# Altium project DataloggerV3.x_Mainboard.PrjPcb (part 1 of 2)
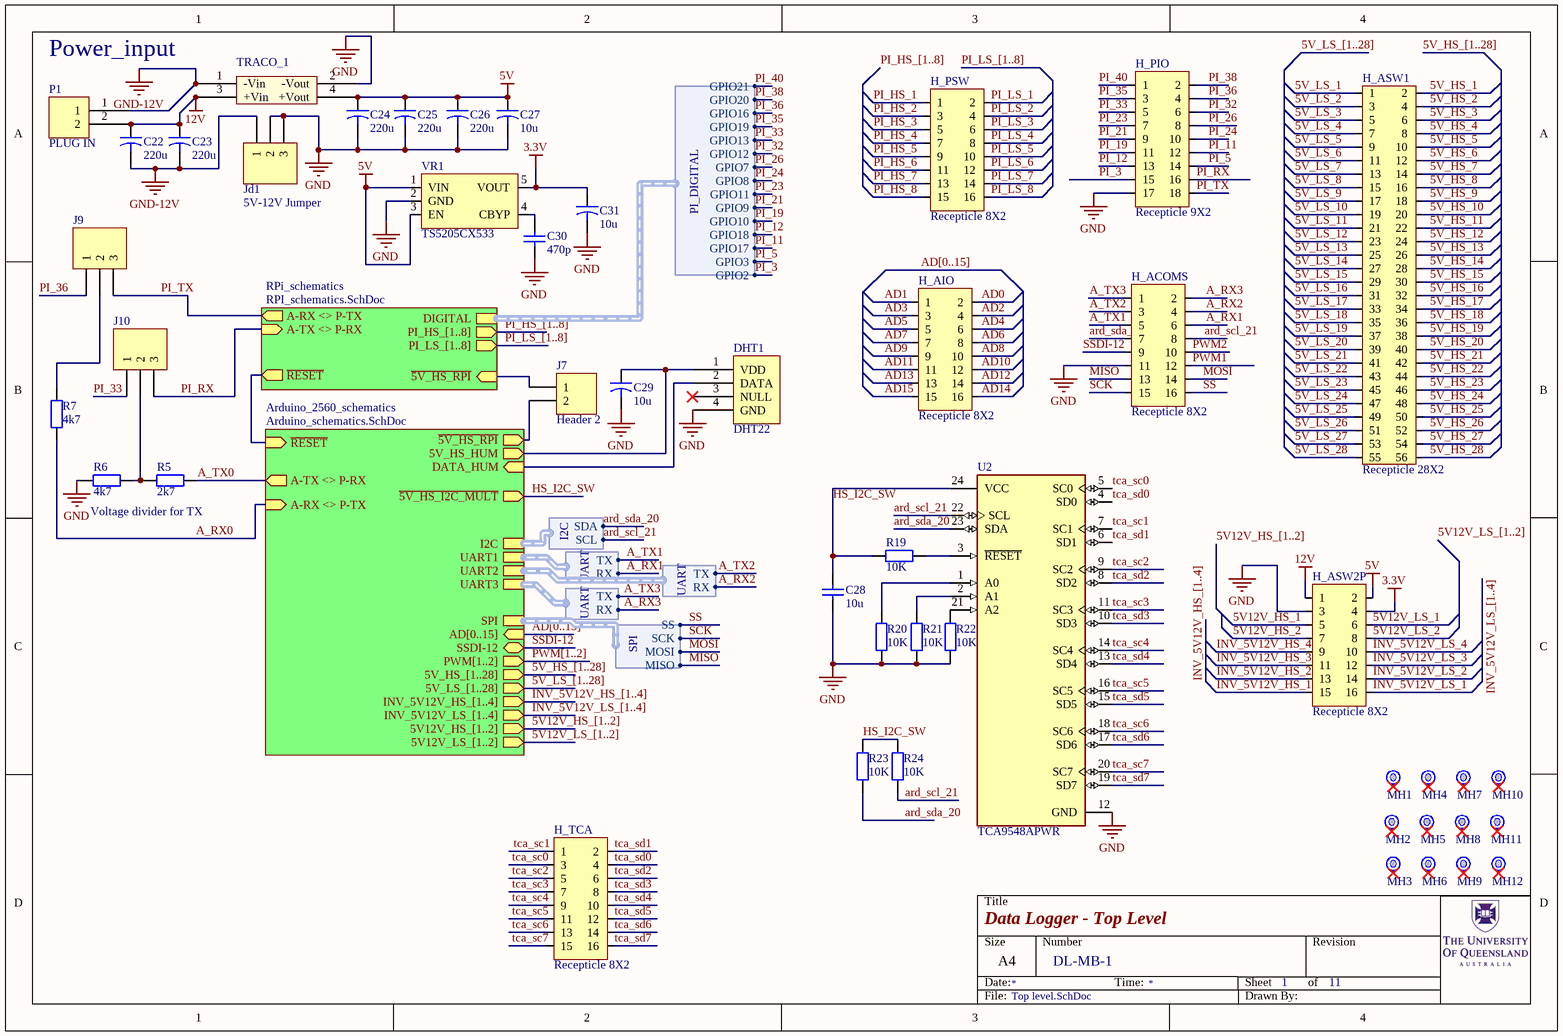
[diagram p0: Top level.SchDoc]
_Revision: 3.2.1B
11 sheets, 223 parts. Net scope: hierarchical (ports join the sheet entries above them; power ports are global).
Board files: PCB4.PcbDoc, PCB3.PcbDoc, PCB2.PcbDoc
Sheets:
  Top level.SchDoc
    RPi_schematics = RPI_schematics.SchDoc
      pi_3.3V_5V_switches = pi_3.3v_5v_switches.SchDoc
        SP1 = HS_LS_Switch_LOW_PWR.SchDoc
        SP2 = HS_LS_Switch_LOW_PWR.SchDoc
        SP3 = HS_LS_Switch_LOW_PWR.SchDoc
        SP4 = HS_LS_Switch_LOW_PWR.SchDoc
    Arduino_2560_schematics = Arduino_schematics.SchDoc
      Arduino switches = 5V_switches.SchDoc
        SA1 = HS_LS_Switch_LOW_PWR.SchDoc
        SA2 = HS_LS_Switch_LOW_PWR.SchDoc
        SA3 = HS_LS_Switch_LOW_PWR.SchDoc
        SA4 = HS_LS_Switch_LOW_PWR.SchDoc
        SA5 = HS_LS_Switch_LOW_PWR.SchDoc
        SA9 = HS_LS_Switch_LOW_PWR.SchDoc
        SA10 = HS_LS_Switch_LOW_PWR.SchDoc
        SA11 = HS_LS_Switch_LOW_PWR.SchDoc
        SA12 = HS_LS_Switch_LOW_PWR.SchDoc
        SA13 = HS_LS_Switch_LOW_PWR.SchDoc
        SA14 = HS_LS_Switch_LOW_PWR.SchDoc
        SA6 = HS_LS_Switch_LOW_PWR.SchDoc
        SA7 = HS_LS_Switch_LOW_PWR.SchDoc
        SA8 = HS_LS_Switch_LOW_PWR.SchDoc
      ISA - Arduino Option Inverted Switches = 12V_5V_switches.SchDoc
        ISA3 = Inverted_HS_LS_switch_HI_PWR.SchDoc
        ISA4 = Inverted_HS_LS_switch_HI_PWR.SchDoc
        ISA1 = Inverted_HS_LS_switch_HI_PWR.SchDoc
        ISA2 = Inverted_HS_LS_switch_HI_PWR.SchDoc
      SAO1 = HS_LS_switch_HI_PWR.SchDoc
      SAO2 = HS_LS_switch_HI_PWR.SchDoc
      SI-SH = HS_Inverted-Normal_Switch_LOW_PWR.SchDoc
      SR = Inverted_HS_switch_HI_PWR.SchDoc

## Sheet Top level.SchDoc: Data Logger - Top Level
size A4; DocumentNumber: DL-MB-1; Revision: 3.2.1B; SheetNumber: 1; SheetTotal: 11

### Parts
C22  220u  [CAPAE9083X80M]
C23  220u  [CAPR5-4X5]
C24  220u  [CAPR5-4X5]
C25  220u  [CAPAE9083X80M]
C26  220u  [CAPR5-4X5]
C27  10u  [CAPR5-4X5]
C28  10u  [RES-1206_M]
C29  10u  [CAPR5-4X5]
C30  470p  [RES-1206_M]
C31  10u  [CAPAE9083X80M]
DHT1  DHT22  [DHT22_HORIZONTAL]
H_ACOMS  Recepticle 8X2  [HDR2X8]
H_AIO  Recepticle 8X2  [HDR2X8]
H_ASW1  Recepticle 28X2  [HDR2X28]
H_ASW2P  Recepticle 8X2  [HDR2X8]
H_PIO  Recepticle 9X2  [HDR2X9]
H_PSW  Recepticle 8X2  [HDR2X8]
H_TCA  Recepticle 8X2  [HDR2X8]
J7  Header 2  [HDR1X2]
J9  Header 3  [HDR1X3]  (value not drawn)
J10  Header 3  [HDR1X3]  (value not drawn)
Jd1  5V-12V Jumper  [HDR1X3]
MH1  MOUNTING_HOLE  [M3]  (value not drawn)
MH2  MOUNTING_HOLE  [M3]  (value not drawn)
MH3  MOUNTING_HOLE  [M3]  (value not drawn)
MH4  MOUNTING_HOLE  [M3]  (value not drawn)
MH5  MOUNTING_HOLE  [M3]  (value not drawn)
MH6  MOUNTING_HOLE  [M3]  (value not drawn)
MH7  MOUNTING_HOLE  [M3]  (value not drawn)
MH8  MOUNTING_HOLE  [M3]  (value not drawn)
MH9  MOUNTING_HOLE  [M3]  (value not drawn)
MH10  MOUNTING_HOLE  [M3]  (value not drawn)
MH11  MOUNTING_HOLE  [M3]  (value not drawn)
MH12  MOUNTING_HOLE  [M3]  (value not drawn)
P1  PLUG IN  [PHOENIX_2PIN]
R5  2k7  [RES-1206_M]
R6  4k7  [RES-1206_M]
R7  4k7  [RES-1206_M]
R19  10K  [RES-1206_M]
R20  10K  [RES-1206_M]
R21  10K  [RES-1206_M]
R22  10K  [RES-1206_M]
R23  10K  [RES-1206_M]
R24  10K  [RES-1206_M]
TRACO_1  TRACO_12vto5.1_151121  [TRACO_12vto5.1_151121]  (value not drawn)
U2  TCA9548APWR  [FP-PW0024A-MFG]
VR1  TS5205CX533  [SOT-25]

### Sub-sheets
Arduino_2560_schematics = Arduino_schematics.SchDoc: ~{5V_HS_RPI} (out), ~{5V_HS_I2C_MULT} (out), DATA_HUM (in), 5V_HS_HUM (out), A-RX <> P-TX (in), A-TX <> P-RX (out), ~{RESET} (in), I2C (harness I2C), SPI (harness SPI), UART1 (harness UART), UART2 (harness UART), UART3 (harness UART), 5V_HS_[1..28] (out), 5V12V_HS_[1..2] (out), AD[0..15] (in), 5V12V_LS_[1..2] (out), INV_5V12V_HS_[1..4] (out), INV_5V12V_LS_[1..4] (out), 5V_LS_[1..28] (out), PWM[1..2] (out), SSDI-12 (bidir)
RPi_schematics = RPI_schematics.SchDoc: ~{5V_HS_RPI} (in), A-TX <> P-RX (in), A-RX <> P-TX (out), ~{RESET} (out), DIGITAL (harness PI_DIGITAL), PI_LS_[1..8] (out), PI_HS_[1..8] (out)

### Harnesses
I2C: SCL, SDA
UART: RX, TX
SPI: MISO, MOSI, SCK, SS
PI_DIGITAL: GPIO2, GPIO3, GPIO17, GPIO18, GPIO10, GPIO9, GPIO11, GPIO8, GPIO7, GPIO12, GPIO13, GPIO19, GPIO16, GPIO20, GPIO21

### Nets
3.3V: C31.1 H_ASW2P.4 VR1.5(VOUT)
5V: C24.1 C25.1 C26.1 C27.1 H_ASW2P.2 TRACO_1.4(+Vout) VR1.1(VIN) VR1.3(EN)
12V: C22.1 C23.1 H_ASW2P.1 P1.2 TRACO_1.3(+Vin)
GND: C24.2 C25.2 C26.2 C27.2 C28.2 C29.2 C30.2 C31.2 DHT1.4(GND) H_ACOMS.11 H_ASW2P.3 H_PIO.17 Jd1.2 Jd1.3 R6.2 R20.2 R21.2 R22.2 TRACO_1.2(-Vout) U2.12(GND) VR1.2(GND)
GND-12V: C22.2 C23.2 Jd1.1 P1.1 TRACO_1.1(-Vin)
5V12V_HS_1: H_ASW2P.5
5V12V_HS_2: H_ASW2P.7
5V12V_LS_1: H_ASW2P.6
5V12V_LS_2: H_ASW2P.8
5V_HS_1: H_ASW1.2
5V_HS_2: H_ASW1.4
5V_HS_3: H_ASW1.6
5V_HS_4: H_ASW1.8
5V_HS_5: H_ASW1.10
5V_HS_6: H_ASW1.12
5V_HS_7: H_ASW1.14
5V_HS_8: H_ASW1.16
5V_HS_9: H_ASW1.18
5V_HS_10: H_ASW1.20
5V_HS_11: H_ASW1.22
5V_HS_12: H_ASW1.24
5V_HS_13: H_ASW1.26
5V_HS_14: H_ASW1.28
5V_HS_15: H_ASW1.30
5V_HS_16: H_ASW1.32
5V_HS_17: H_ASW1.34
5V_HS_18: H_ASW1.36
5V_HS_19: H_ASW1.38
5V_HS_20: H_ASW1.40
5V_HS_21: H_ASW1.42
5V_HS_22: H_ASW1.44
5V_HS_23: H_ASW1.46
5V_HS_24: H_ASW1.48
5V_HS_25: H_ASW1.50
5V_HS_26: H_ASW1.52
5V_HS_27: H_ASW1.54
5V_HS_28: H_ASW1.56
5V_LS_1: H_ASW1.1
5V_LS_2: H_ASW1.3
5V_LS_3: H_ASW1.5
5V_LS_4: H_ASW1.7
5V_LS_5: H_ASW1.9
5V_LS_6: H_ASW1.11
5V_LS_7: H_ASW1.13
5V_LS_8: H_ASW1.15
5V_LS_9: H_ASW1.17
5V_LS_10: H_ASW1.19
5V_LS_11: H_ASW1.21
5V_LS_12: H_ASW1.23
5V_LS_13: H_ASW1.25
5V_LS_14: H_ASW1.27
5V_LS_15: H_ASW1.29
5V_LS_16: H_ASW1.31
5V_LS_17: H_ASW1.33
5V_LS_18: H_ASW1.35
5V_LS_19: H_ASW1.37
5V_LS_20: H_ASW1.39
5V_LS_21: H_ASW1.41
5V_LS_22: H_ASW1.43
5V_LS_23: H_ASW1.45
5V_LS_24: H_ASW1.47
5V_LS_25: H_ASW1.49
5V_LS_26: H_ASW1.51
5V_LS_27: H_ASW1.53
5V_LS_28: H_ASW1.55
A_RX0: R7.2 ; sheet Arduino_2560_schematics/A-RX <> P-TX
A_RX1: H_ACOMS.6 ; sheet Arduino_2560_schematics/UART1.RX
A_RX2: H_ACOMS.4 ; sheet Arduino_2560_schematics/UART2.RX
A_RX3: H_ACOMS.2 ; sheet Arduino_2560_schematics/UART3.RX
A_TX0: R5.1 ; sheet Arduino_2560_schematics/A-TX <> P-RX
A_TX1: H_ACOMS.5 ; sheet Arduino_2560_schematics/UART1.TX
A_TX2: H_ACOMS.3 ; sheet Arduino_2560_schematics/UART2.TX
A_TX3: H_ACOMS.1 ; sheet Arduino_2560_schematics/UART3.TX
AD0: DHT1.2(DATA) H_AIO.2 ; sheet Arduino_2560_schematics/DATA_HUM
AD1: H_AIO.1
AD2: H_AIO.4
AD3: H_AIO.3
AD4: H_AIO.6
AD5: H_AIO.5
AD6: H_AIO.8
AD7: H_AIO.7
AD8: H_AIO.10
AD9: H_AIO.9
AD10: H_AIO.12
AD11: H_AIO.11
AD12: H_AIO.14
AD13: H_AIO.13
AD14: H_AIO.16
AD15: H_AIO.15
ard_scl_21: H_ACOMS.8 R24.2 U2.22(SCL) ; sheet Arduino_2560_schematics/I2C.SCL
ard_sda_20: H_ACOMS.7 R23.2 U2.23(SDA) ; sheet Arduino_2560_schematics/I2C.SDA
HS_I2C_SW: C28.1 R19.1 R23.1 R24.1 U2.24(VCC) ; sheet Arduino_2560_schematics/~{5V_HS_I2C_MULT}
INV_5V12V_HS_1: H_ASW2P.15
INV_5V12V_HS_2: H_ASW2P.13
INV_5V12V_HS_3: H_ASW2P.11
INV_5V12V_HS_4: H_ASW2P.9
INV_5V12V_LS_1: H_ASW2P.16
INV_5V12V_LS_2: H_ASW2P.14
INV_5V12V_LS_3: H_ASW2P.12
INV_5V12V_LS_4: H_ASW2P.10
MISO: H_ACOMS.13 ; sheet Arduino_2560_schematics/SPI.MISO
MOSI: H_ACOMS.14 ; sheet Arduino_2560_schematics/SPI.MOSI
PI_3: H_PIO.15 ; sheet RPi_schematics/DIGITAL.GPIO2
PI_5: H_PIO.14 ; sheet RPi_schematics/DIGITAL.GPIO3
PI_11: H_PIO.12 ; sheet RPi_schematics/DIGITAL.GPIO17
PI_12: H_PIO.13 ; sheet RPi_schematics/DIGITAL.GPIO18
PI_13: sheet RPi_schematics/~{RESET}, sheet Arduino_2560_schematics/~{RESET}
PI_19: H_PIO.11 ; sheet RPi_schematics/DIGITAL.GPIO10
PI_21: H_PIO.9 ; sheet RPi_schematics/DIGITAL.GPIO9
PI_23: H_PIO.7 ; sheet RPi_schematics/DIGITAL.GPIO11
PI_24: H_PIO.10 ; sheet RPi_schematics/DIGITAL.GPIO8
PI_26: H_PIO.8 ; sheet RPi_schematics/DIGITAL.GPIO7
PI_32: H_PIO.6 ; sheet RPi_schematics/DIGITAL.GPIO12
PI_33: H_PIO.5 J10.1 ; sheet RPi_schematics/DIGITAL.GPIO13
PI_35: H_PIO.3 ; sheet RPi_schematics/DIGITAL.GPIO19
PI_36: H_PIO.4 J9.1 ; sheet RPi_schematics/DIGITAL.GPIO16
PI_38: H_PIO.2 ; sheet RPi_schematics/DIGITAL.GPIO20
PI_40: H_PIO.1 ; sheet RPi_schematics/DIGITAL.GPIO21
PI_HS_1: H_PSW.1
PI_HS_2: H_PSW.3
PI_HS_3: H_PSW.5
PI_HS_4: H_PSW.7
PI_HS_5: H_PSW.9
PI_HS_6: H_PSW.11
PI_HS_7: H_PSW.13
PI_HS_8: H_PSW.15
PI_LS_1: H_PSW.2
PI_LS_2: H_PSW.4
PI_LS_3: H_PSW.6
PI_LS_4: H_PSW.8
PI_LS_5: H_PSW.10
PI_LS_6: H_PSW.12
PI_LS_7: H_PSW.14
PI_LS_8: H_PSW.16
PI_RX: H_PIO.16 J10.3 ; sheet RPi_schematics/A-TX <> P-RX  [project net A-TX <> P-RX]
PI_TX: H_PIO.18 J9.3 ; sheet RPi_schematics/A-RX <> P-TX  [project net A-RX <> P-TX]
PWM1: H_ACOMS.12
PWM2: H_ACOMS.10
rpi_5v_1: J7.1 ; sheet RPi_schematics/~{5V_HS_RPI}
SCK: H_ACOMS.15 ; sheet Arduino_2560_schematics/SPI.SCK
SS: H_ACOMS.16 ; sheet Arduino_2560_schematics/SPI.SS
SSDI-12: H_ACOMS.9 ; sheet Arduino_2560_schematics/SSDI-12
tca_sc0: H_TCA.3 U2.5(SC0)
tca_sc1: H_TCA.1 U2.7(SC1)
tca_sc2: H_TCA.5 U2.9(SC2)
tca_sc3: H_TCA.7 U2.11(SC3)
tca_sc4: H_TCA.9 U2.14(SC4)
tca_sc5: H_TCA.11 U2.16(SC5)
tca_sc6: H_TCA.13 U2.18(SC6)
tca_sc7: H_TCA.15 U2.20(SC7)
tca_sd0: H_TCA.4 U2.4(SD0)
tca_sd1: H_TCA.2 U2.6(SD1)
tca_sd2: H_TCA.6 U2.8(SD2)
tca_sd3: H_TCA.8 U2.10(SD3)
tca_sd4: H_TCA.10 U2.13(SD4)
tca_sd5: H_TCA.12 U2.15(SD5)
tca_sd6: H_TCA.14 U2.17(SD6)
tca_sd7: H_TCA.16 U2.19(SD7)
NetC29_1: C29.1 DHT1.1(VDD) ; sheet Arduino_2560_schematics/5V_HS_HUM
NetC30_1: C30.1 VR1.4(CBYP)
NetJ7_2: J7.2 ; sheet Arduino_2560_schematics/~{5V_HS_RPI}
NetJ9_2: J9.2 R7.1
NetJ10_2: J10.2 R5.2 R6.1
NetR19_2: R19.2 U2.3(~{RESET})
NetR20_1: R20.1 U2.1(A0)
NetR21_1: R21.1 U2.2(A1)
NetR22_1: R22.1 U2.21(A2)

Not connected (* = marked no-connect by the designer): DHT1 3(NULL)*; MH1 0*; MH2 0*; MH3 0*; MH4 0*; MH5 0*; MH6 0*; MH7 0*; MH8 0*; MH9 0*; MH10 0*; MH11 0*; MH12 0*

### Buses and harness runs
bus 5V12V_HS_[1..2]
bus 5V12V_HS_[1..2] = sheet Arduino_2560_schematics/5V12V_HS_[1..2]
bus 5V12V_LS_[1..2]
bus 5V12V_LS_[1..2] = sheet Arduino_2560_schematics/5V12V_LS_[1..2]
bus 5V_HS_[1..28]
bus 5V_HS_[1..28] = sheet Arduino_2560_schematics/5V_HS_[1..28]
bus 5V_LS_[1..28]
bus 5V_LS_[1..28] = sheet Arduino_2560_schematics/5V_LS_[1..28]
bus AD[0..15]
bus AD[0..15] = sheet Arduino_2560_schematics/AD[0..15]
bus INV_5V12V_HS_[1..4]
bus INV_5V12V_HS_[1..4] = sheet Arduino_2560_schematics/INV_5V12V_HS_[1..4]
bus INV_5V12V_LS_[1..4]
bus INV_5V12V_LS_[1..4] = sheet Arduino_2560_schematics/INV_5V12V_LS_[1..4]
bus PI_HS_[1..8]
bus PI_HS_[1..8] = sheet RPi_schematics/PI_HS_[1..8]
bus PI_LS_[1..8]
bus PI_LS_[1..8] = sheet RPi_schematics/PI_LS_[1..8]
bus PWM[1..2] = sheet Arduino_2560_schematics/PWM[1..2]

### Notes on the sheet
- Power_input
- Voltage divider for TX
- Title
- Size
- Date:
- A4
- Number
- Time:
- Sheet
- of
- Revision
- File:
- Drawn By:

### Library data of the parts
C22-C27 C29 C31 = Cap Pol1: Capacitor; Publisher: Altium Limited; PackageDescription: Polarized Capacitor; 2 Leads
  C22 C25: Published: 23-Sep-2002; Value: 220u
  C23 C24 C26: Published: 23-Sep-02; Value: 220u; Link: https://au.rs-online.com/web/p/aluminium-capacitors/1918277/
  C27 C29: Published: 23-Sep-02; Value: 10u; Link: https://au.rs-online.com/web/p/aluminium-capacitors/2244325/
  C31: Published: 23-Sep-02; Value: 10u
C28 C30 = Cap Semi: Capacitor (Semiconductor SIM Model); Published: 8-Jun-2000; Publisher: Altium Limited; PackageDescription: Chip Capacitor; LatestRevisionDate: 29-May-2009; LatestRevisionNote: IPC-7351 Footprint Added.
  C28: PackageReference: C0805; Value: 10u
  C30: PackageReference: C1206; Value: 470p
H_ACOMS H_AIO H_ASW2P H_PSW H_TCA = Header 8X2: Header, 8-Pin, Dual row; System: Connector; LatestRevisionDate: 17-Jul-2002; LatestRevisionNote: Re-released for DXP Platform.; Publisher: Altium Limited
H_ASW1 = Header 28X2: Header, 28-Pin, Dual row; System: Connector; LatestRevisionDate: 17-Jul-2002; LatestRevisionNote: Re-released for DXP Platform.; Publisher: Altium Limited
H_PIO = Header 9X2: Header, 9-Pin, Dual row; System: Connector; LatestRevisionDate: 17-Jul-2002; LatestRevisionNote: Re-released for DXP Platform.; Publisher: Altium Limited
J7 = Header 2: Header, 2-Pin / Arduino->RPI Power; LatestRevisionDate: 17-Jul-2002; LatestRevisionNote: Re-released for DXP Platform.; Publisher: Altium Limited
J9 J10 = Header 3: Header, 3-Pin; LatestRevisionDate: 17-Jul-2002; LatestRevisionNote: Re-released for DXP Platform.; Publisher: Altium Limited
Jd1 = Header 3: 12V and 5v Tie in Ground; LatestRevisionDate: 17-Jul-2002; LatestRevisionNote: Re-released for DXP Platform.; Publisher: Altium Limited
MH1-MH12 = MOUNTING_HOLE: M3 Mounting Hole
P1 = Phoenix_2pin
R5-R7 R19-R24 = Res2: Resistor; Published: 8-Jun-2000; LatestRevisionDate: 17-Jul-2002; LatestRevisionNote: Re-released for DXP Platform.; PackageReference: 1206; Publisher: Altium Limited; PackageDescription: Chip Resistor 1206 Case Size
  R5: Value: 2k7
  R6 R7: Value: 4k7
  R19-R24: Value: 10K
TRACO_1 = TRACO_12vto5.1_151121: TRACOPOWER TEL 15 15W Isolated DC-DC Converter Through Hole, Voltage in 9 → 18 V dc, Voltage out 5.1V dc; Link: https://au.rs-online.com/web/p/isolated-dc-dc-converters/1665605/; Supplier 1: Mouser; Supplier 2: RSComponents; Supplier 3: RSComponents; Supplier 4: RSComponents; Supplier Part Number 1: 495-TEL-15-1211; Supplier Part Number 2: 5106046; Supplier Part Number 3: 5106046P; Supplier Part Number 4: 1665605
U2 = CMP-04892-000002-1: IC I2C SW 8CH W/RESET 24TSSOP; Manufacturer: Texas Instruments; Number Of Circuits: 1; Mux Demux Ratio: 1:8; Nominal Supply Current: 2-50uA; Interface: I2C,SMBus; Min Supply Voltage: 1.65V; Standoff Height: 0.05mm; Max Supply Voltage: 5.5V; Device Class L2: Interface ICs; ComponentLink2Description: Datasheet; Ipc Land Pattern Name: SOP65P640X120-24; Category: IC; Device Class L1: Integrated Circuits (ICs); Manufacturer Part Number: TCA9548APWR; RoHS: TRUE; Temperature Range High: +85°C; Digikey Description: IC I2C SW 8CH W/RESET 24TSSOP; Temperature Range Low: -40°C; Lead Free: Yes; Package: PW0024A; ComponentLink2URL: http://www.ti.com/lit/ds/symlink/tca9548a.pdf; Device Class L3: Multiplexers; Ambient Temperature Range Low: -40°C; Mouser Description: Low-Voltage 8-Channel I2C Switch With Reset 24-TSSOP -40 to 85; Temperature: -40°C to +85°C; Octopart: https://octopart.com/tca9548apwr-texas+instruments-22266789; Ambient Temperature Range High: +85°C; Automotive: No; Height: 1.2mm
VR1 = TS5205: 150mA Low Noise LDO Voltage Regulator with Enable Function; PackageReference: SOT-25

## Sheet RPI_schematics.SchDoc: Data Logger - RPI
size A4; DocumentNumber: DL-MB-3; Revision: 3.2.1B; SheetNumber: 3; SheetTotal: 11
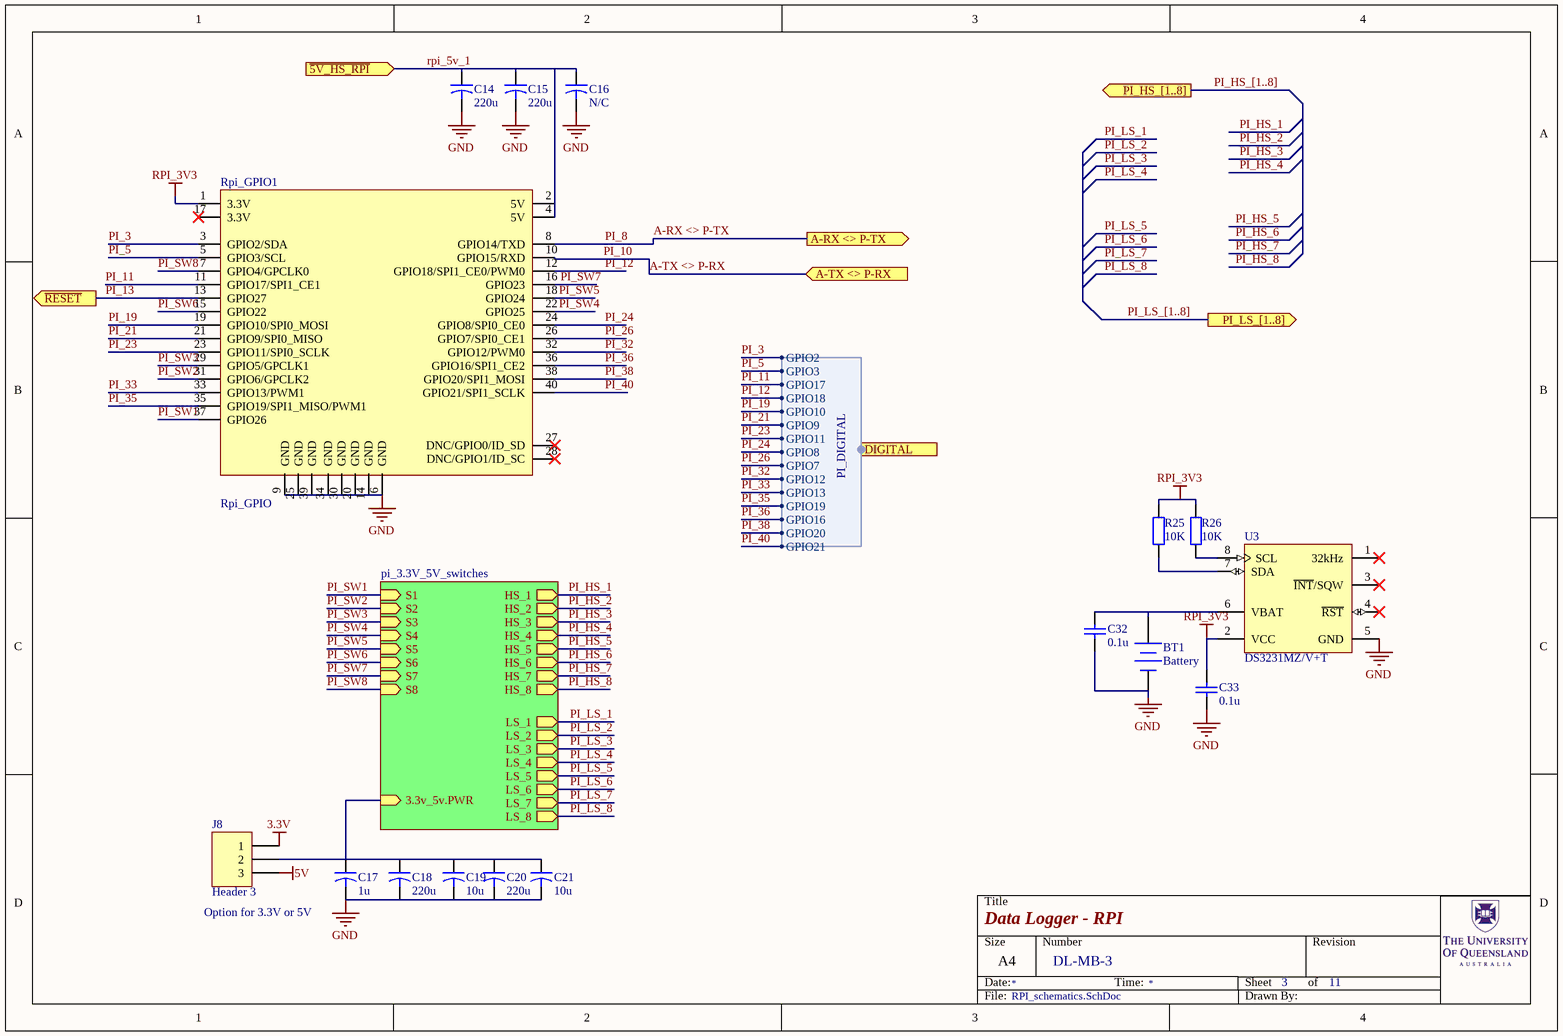
[diagram p1: RPI_schematics.SchDoc]

### Parts
BT1  Battery  [COIN-2032]
C14  220u  [CAPR5-4X5]
C15  220u  [CAPAE9083X80M]
C16  N/C  [CAPR5-4X5]
C17  1u  [CAPR5-4X5]
C18  220u  [CAPAE9083X80M]
C19  10u  [CAPR5-4X5]
C20  220u  [CAPR5-4X5]
C21  10u  [CAPR5-4X5]
C32  0.1u  [RES-1206_M]
C33  0.1u  [RES-1206_M]
J8  Header 3  [HDR1X3]
R25  10K  [RES-1206_M]
R26  10K  [RES-1206_M]
Rpi_GPIO1  Rpi_GPIO  [RPI_Z_GPIO_HDR2X20]
U3  DS3231MZ/V+T  [S8MK+1_N]

### Sub-sheets
pi_3.3V_5V_switches = pi_3.3v_5v_switches.SchDoc: S1 (in), HS_1 (out), LS_1 (out), S2 (in), S3 (in), S4 (in), S5 (in), S6 (in), S7 (in), S8 (in), HS_2 (out), HS_3 (out), HS_4 (out), HS_5 (out), HS_6 (out), HS_7 (out), HS_8 (out), LS_2 (out), LS_3 (out), LS_4 (out), LS_5 (out), LS_6 (out), LS_7 (out), LS_8 (out), 3.3v_5v.PWR (in)

### Ports
A-RX <> P-TX (out), A-TX <> P-RX (in), DIGITAL (in, harness PI_DIGITAL), PI_HS_[1..8] (out), PI_LS_[1..8] (out), ~{5V_HS_RPI} (in), ~{RESET} (out)

### Harnesses
PI_DIGITAL: GPIO2, GPIO3, GPIO17, GPIO18, GPIO10, GPIO9, GPIO11, GPIO8, GPIO7, GPIO12, GPIO13, GPIO19, GPIO16, GPIO20, GPIO21

### Nets
3.3V: J8.1
5V: J8.3
GND: BT1.2(-) C14.2 C15.2 C16.2 C17.2 C18.2 C19.2 C20.2 C21.2 C32.2 C33.2 Rpi_GPIO1.6(GND) Rpi_GPIO1.9(GND) Rpi_GPIO1.14(GND) Rpi_GPIO1.20(GND) Rpi_GPIO1.25(GND) Rpi_GPIO1.30(GND) Rpi_GPIO1.34(GND) Rpi_GPIO1.39(GND) U3.5(GND)
RPI_3V3: C33.1 R25.1 R26.1 Rpi_GPIO1.1(3.3V) U3.2(VCC)
A-RX <> P-TX: Rpi_GPIO1.8(GPIO14/TXD) ; port A-RX <> P-TX  [also labelled PI_8]
A-TX <> P-RX: Rpi_GPIO1.10(GPIO15/RXD) ; port A-TX <> P-RX  [also labelled PI_10]
PI_3: Rpi_GPIO1.3(GPIO2/SDA) ; port DIGITAL.GPIO2
PI_5: Rpi_GPIO1.5(GPIO3/SCL) ; port DIGITAL.GPIO3
PI_11: Rpi_GPIO1.11(GPIO17/SPI1_CE1) ; port DIGITAL.GPIO17
PI_12: Rpi_GPIO1.12(GPIO18/SPI1_CE0/PWM0) ; port DIGITAL.GPIO18
PI_13: Rpi_GPIO1.13(GPIO27) ; port ~{RESET}
PI_19: Rpi_GPIO1.19(GPIO10/SPI0_MOSI) ; port DIGITAL.GPIO10
PI_21: Rpi_GPIO1.21(GPIO9/SPI0_MISO) ; port DIGITAL.GPIO9
PI_23: Rpi_GPIO1.23(GPIO11/SPI0_SCLK) ; port DIGITAL.GPIO11
PI_24: Rpi_GPIO1.24(GPIO8/SPI0_CE0) ; port DIGITAL.GPIO8
PI_26: Rpi_GPIO1.26(GPIO7/SPI0_CE1) ; port DIGITAL.GPIO7
PI_32: Rpi_GPIO1.32(GPIO12/PWM0) ; port DIGITAL.GPIO12
PI_33: Rpi_GPIO1.33(GPIO13/PWM1) ; port DIGITAL.GPIO13
PI_35: Rpi_GPIO1.35(GPIO19/SPI1_MISO/PWM1) ; port DIGITAL.GPIO19
PI_36: Rpi_GPIO1.36(GPIO16/SPI1_CE2) ; port DIGITAL.GPIO16
PI_38: Rpi_GPIO1.38(GPIO20/SPI1_MOSI) ; port DIGITAL.GPIO20
PI_40: Rpi_GPIO1.40(GPIO21/SPI1_SCLK) ; port DIGITAL.GPIO21
PI_SW1: Rpi_GPIO1.37(GPIO26) ; sheet pi_3.3V_5V_switches/S1
PI_SW2: Rpi_GPIO1.31(GPIO6/GPCLK2) ; sheet pi_3.3V_5V_switches/S2
PI_SW3: Rpi_GPIO1.29(GPIO5/GPCLK1) ; sheet pi_3.3V_5V_switches/S3
PI_SW4: Rpi_GPIO1.22(GPIO25) ; sheet pi_3.3V_5V_switches/S4
PI_SW5: Rpi_GPIO1.18(GPIO24) ; sheet pi_3.3V_5V_switches/S5
PI_SW6: Rpi_GPIO1.15(GPIO22) ; sheet pi_3.3V_5V_switches/S6
PI_SW7: Rpi_GPIO1.16(GPIO23) ; sheet pi_3.3V_5V_switches/S7
PI_SW8: Rpi_GPIO1.7(GPIO4/GPCLK0) ; sheet pi_3.3V_5V_switches/S8
rpi_5v_1: C14.1 C15.1 C16.1 Rpi_GPIO1.2(5V) Rpi_GPIO1.4(5V) ; port ~{5V_HS_RPI}
NetBT1_1: BT1.1(+) C32.1 U3.6(VBAT)
NetC17_1: C17.1 C18.1 C19.1 C20.1 C21.1 J8.2 ; sheet pi_3.3V_5V_switches/3.3v_5v.PWR
NetR25_2: R25.2 U3.7(SDA)
NetR26_2: R26.2 U3.8(SCL)

Not connected (* = marked no-connect by the designer): Rpi_GPIO1 17(3.3V)* 27(DNC/GPIO0/ID_SD)* 28(DNC/GPIO1/ID_SC)*; U3 1(32kHz)* 3(~{INT}/SQW)* 4(~{RST})*

### Buses and harness runs
bus PI_HS_[1..8] = port PI_HS_[1..8]
bus PI_LS_[1..8] = port PI_LS_[1..8]

### Notes on the sheet
- Option for 3.3V or 5V
- Title
- Size
- Date:
- A4
- Number
- Time:
- Sheet
- of
- Revision
- File:
- Drawn By:

### Library data of the parts
BT1 = Battery: Multicell Battery; PackageReference: COIN-2032; PackageDescription: Coin Battery; 2 Leads
C14-C21 = Cap Pol1: Capacitor; Publisher: Altium Limited; PackageDescription: Polarized Capacitor; 2 Leads
  C14 C20: Published: 23-Sep-02; Value: 220u; Link: https://au.rs-online.com/web/p/aluminium-capacitors/1918277/
  C15 C18: Published: 23-Sep-2002; Value: 220u
  C16: Published: 23-Sep-02; Value: N/C
  C17: Published: 23-Sep-02; Value: 1u; Link: https://au.rs-online.com/web/p/ceramic-multilayer-capacitors/6995137/
  C19 C21: Published: 23-Sep-02; Value: 10u; Link: https://au.rs-online.com/web/p/aluminium-capacitors/2244325/
C32 C33 = Cap Semi: Capacitor (Semiconductor SIM Model); Published: 8-Jun-2000; PackageReference: C1206; Publisher: Altium Limited; PackageDescription: Chip Capacitor; Value: 0.1u; LatestRevisionDate: 29-May-2009; LatestRevisionNote: IPC-7351 Footprint Added.
J8 = Header 3: Header, 3-Pin / RPI, 5V or 3V Power; LatestRevisionDate: 17-Jul-2002; LatestRevisionNote: Re-released for DXP Platform.; Publisher: Altium Limited
R25 R26 = Res2: Resistor; Published: 8-Jun-2000; LatestRevisionDate: 17-Jul-2002; LatestRevisionNote: Re-released for DXP Platform.; PackageReference: 1206; Publisher: Altium Limited; PackageDescription: Chip Resistor 1206 Case Size; Value: 10K
Rpi_GPIO1 = Rpi_GPIO_1: Header, 20-Pin, Dual row; LatestRevisionDate: 17-Jul-2002; LatestRevisionNote: Re-released for DXP Platform.; Publisher: Altium Limited
U3 = CMP-0254-00373-1: +/-5ppm, I2C Real-Time Clock with Internal MEMs Resonator, 8-Pin SO, -40 to 85 degC, Automotive Qualified, Pb-Free, Reel; DatasheetVersion: Rev 3, Dec-2011; ComponentLink2Description: Datasheet; ComponentLink2URL: http://datasheets.maxim-ic.com/en/ds/DS3231M.pdf; PackageVersion: revC, 2010; PackageReference: S8MK+1; Code_IPC: SOIC127P600-8; PackageDescription: 8-Pin Small-Outline IC, Narrow (0.15in), 1.27 mm Pitch, SOIC (N), Pb-Free; Code_JEDEC: MS-012-AA; ComponentLink3URL: http://pdfserv.maxim-ic.com/package_dwgs/21-0041.PDF; ComponentLink3Description: Package Specification; ComponentLink1Description: Manufacturer URL; ComponentLink1URL: http://www.maxim-ic.com

## Sheet pi_3.3v_5v_switches.SchDoc: Data Logger - RPI 3.3V,5V Switches
size A4; DocumentNumber: DL-MB-9; Revision: 3.2.1B; SheetNumber: 9; SheetTotal: 11
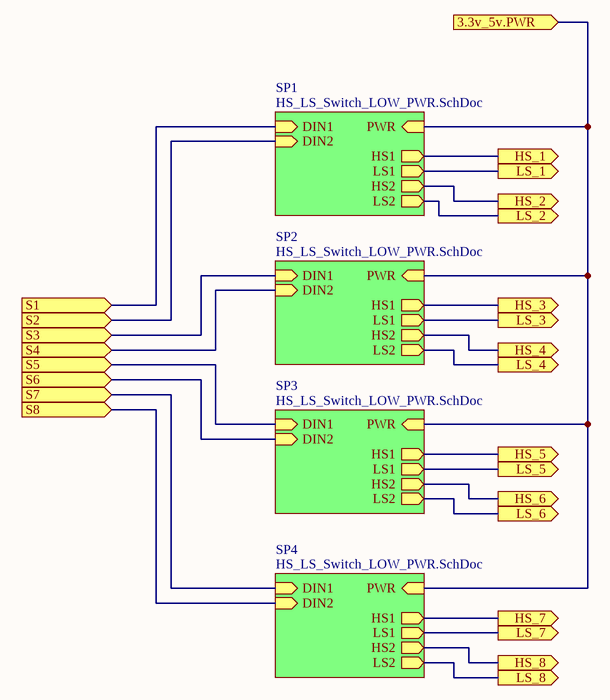
[diagram p2: pi_3.3v_5v_switches.SchDoc]

### Sub-sheets
SP1 = HS_LS_Switch_LOW_PWR.SchDoc: DIN1 (in), DIN2 (in), HS1 (out), LS1 (out), HS2 (out), LS2 (out), PWR (in)
SP2 = HS_LS_Switch_LOW_PWR.SchDoc: DIN1 (in), DIN2 (in), HS1 (out), LS1 (out), HS2 (out), LS2 (out), PWR (in)
SP3 = HS_LS_Switch_LOW_PWR.SchDoc: DIN1 (in), DIN2 (in), HS1 (out), LS1 (out), HS2 (out), LS2 (out), PWR (in)
SP4 = HS_LS_Switch_LOW_PWR.SchDoc: DIN1 (in), DIN2 (in), HS1 (out), LS1 (out), HS2 (out), LS2 (out), PWR (in)

### Ports
3.3v_5v.PWR (in), HS_1 (out), HS_2 (out), HS_3 (out), HS_4 (out), HS_5 (out), HS_6 (out), HS_7 (out), HS_8 (out), LS_1 (out), LS_2 (out), LS_3 (out), LS_4 (out), LS_5 (out), LS_6 (out), LS_7 (out), LS_8 (out), S1 (in), S2 (in), S3 (in), S4 (in), S5 (in), S6 (in), S7 (in), S8 (in)

### Nets
PI_HS_1: port HS_1, sheet SP1/HS1
PI_HS_2: port HS_2, sheet SP1/HS2
PI_HS_3: port HS_3, sheet SP2/HS1
PI_HS_4: port HS_4, sheet SP2/HS2
PI_HS_5: port HS_5, sheet SP3/HS1
PI_HS_6: port HS_6, sheet SP3/HS2
PI_HS_7: port HS_7, sheet SP4/HS1
PI_HS_8: port HS_8, sheet SP4/HS2
PI_LS_1: port LS_1, sheet SP1/LS1
PI_LS_2: port LS_2, sheet SP1/LS2
PI_LS_3: port LS_3, sheet SP2/LS1
PI_LS_4: port LS_4, sheet SP2/LS2
PI_LS_5: port LS_5, sheet SP3/LS1
PI_LS_6: port LS_6, sheet SP3/LS2
PI_LS_7: port LS_7, sheet SP4/LS1
PI_LS_8: port LS_8, sheet SP4/LS2
PI_SW1: port S1, sheet SP1/DIN1
PI_SW2: port S2, sheet SP1/DIN2
PI_SW3: port S3, sheet SP2/DIN1
PI_SW4: port S4, sheet SP2/DIN2
PI_SW5: port S5, sheet SP3/DIN1
PI_SW6: port S6, sheet SP3/DIN2
PI_SW7: port S7, sheet SP4/DIN1
PI_SW8: port S8, sheet SP4/DIN2
NetC17_1: port 3.3v_5v.PWR, sheet SP1/PWR, sheet SP2/PWR, sheet SP3/PWR, sheet SP4/PWR

### Notes on the sheet
- Title
- Size
- Date:
- A4
- Number
- Time:
- Sheet
- of
- Revision
- File:
- Drawn By:

## Sheet HS_LS_Switch_LOW_PWR.SchDoc: Data Logger - HS LS Low Power Switches
size A4; DocumentNumber: DL-MB-11; Revision: 3.2.1B; SheetNumber: 11; SheetTotal: 11
Used 18 times, as channels RPi_schematics/pi_3.3V_5V_switches/SP1, RPi_schematics/pi_3.3V_5V_switches/SP2, RPi_schematics/pi_3.3V_5V_switches/SP3, RPi_schematics/pi_3.3V_5V_switches/SP4, Arduino_2560_schematics/Arduino switches/SA1, Arduino_2560_schematics/Arduino switches/SA2, Arduino_2560_schematics/Arduino switches/SA3, Arduino_2560_schematics/Arduino switches/SA4, Arduino_2560_schematics/Arduino switches/SA5, Arduino_2560_schematics/Arduino switches/SA9, Arduino_2560_schematics/Arduino switches/SA10, Arduino_2560_schematics/Arduino switches/SA11, Arduino_2560_schematics/Arduino switches/SA12, Arduino_2560_schematics/Arduino switches/SA13, Arduino_2560_schematics/Arduino switches/SA14, Arduino_2560_schematics/Arduino switches/SA6, Arduino_2560_schematics/Arduino switches/SA7, Arduino_2560_schematics/Arduino switches/SA8. Parts and nets are listed once, with the designators drawn on the sheet.
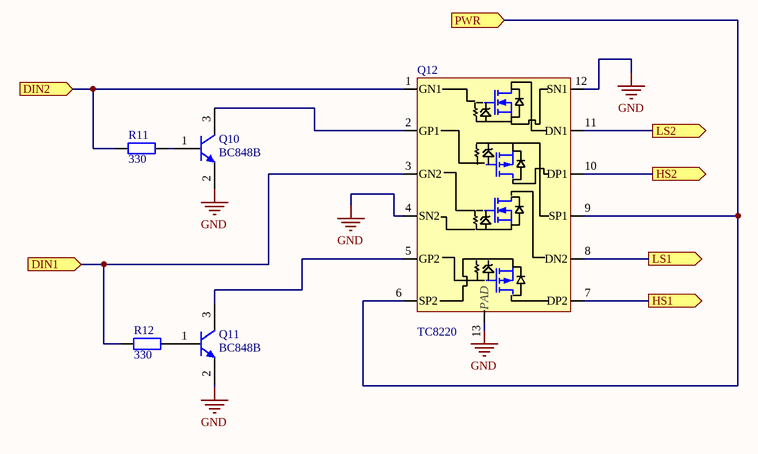
[diagram p3: HS_LS_Switch_LOW_PWR.SchDoc]

### Parts
Q10  BC848B  [SOT23_N]
Q11  BC848B  [SOT23_N]
Q12  TC8220  [DFN400X400X100-12]
R11  330  [RES-1206_M]
R12  330  [RES-1206_M]

### Ports
DIN1 (in), DIN2 (in), HS1 (out), HS2 (out), LS1 (out), LS2 (out), PWR (in)

### Nets
GND: Q10.2(E) Q11.2(E) Q12.4(SN2) Q12.12(SN1) Q12.13(PAD)
DIN1: Q12.3(GN2) R12.1 ; port DIN1
DIN2: Q12.1(GN1) R11.1 ; port DIN2
HS1: Q12.7(DP2) ; port HS1
HS2: Q12.10(DP1) ; port HS2
LS1: Q12.8(DN2) ; port LS1
LS2: Q12.11(DN1) ; port LS2
PWR: Q12.6(SP2) Q12.9(SP1) ; port PWR
NetQ10_1: Q10.1(B) R11.2
NetQ10_3: Q10.3(C) Q12.2(GP1)
NetQ11_1: Q11.1(B) R12.2
NetQ11_3: Q11.3(C) Q12.5(GP2)

### Channels
RPi_schematics/pi_3.3V_5V_switches/SP1: designators Q10=SP1.Q10 Q11=SP1.Q11 Q12=SP1.Q12 R11=SP1.R11 R12=SP1.R12; ports DIN1=PI_SW1 DIN2=PI_SW2 HS1=PI_HS_1 HS2=PI_HS_2 LS1=PI_LS_1 LS2=PI_LS_2 PWR=NetC17_1
RPi_schematics/pi_3.3V_5V_switches/SP2: designators Q10=SP2.Q10 Q11=SP2.Q11 Q12=SP2.Q12 R11=SP2.R11 R12=SP2.R12; ports DIN1=PI_SW3 DIN2=PI_SW4 HS1=PI_HS_3 HS2=PI_HS_4 LS1=PI_LS_3 LS2=PI_LS_4 PWR=NetC17_1
RPi_schematics/pi_3.3V_5V_switches/SP3: designators Q10=SP3.Q10 Q11=SP3.Q11 Q12=SP3.Q12 R11=SP3.R11 R12=SP3.R12; ports DIN1=PI_SW5 DIN2=PI_SW6 HS1=PI_HS_5 HS2=PI_HS_6 LS1=PI_LS_5 LS2=PI_LS_6 PWR=NetC17_1
RPi_schematics/pi_3.3V_5V_switches/SP4: designators Q10=SP4.Q10 Q11=SP4.Q11 Q12=SP4.Q12 R11=SP4.R11 R12=SP4.R12; ports DIN1=PI_SW7 DIN2=PI_SW8 HS1=PI_HS_7 HS2=PI_HS_8 LS1=PI_LS_7 LS2=PI_LS_8 PWR=NetC17_1
Arduino_2560_schematics/Arduino switches/SA1: designators Q10=SA1.Q10 Q11=SA1.Q11 Q12=SA1.Q12 R11=SA1.R11 R12=SA1.R12; ports DIN1=5V_SW1 DIN2=5V_SW2 HS1=5V_HS_1 HS2=5V_HS_2 LS1=5V_LS_1 LS2=5V_LS_2 PWR=5V
Arduino_2560_schematics/Arduino switches/SA2: designators Q10=SA2.Q10 Q11=SA2.Q11 Q12=SA2.Q12 R11=SA2.R11 R12=SA2.R12; ports DIN1=5V_SW3 DIN2=5V_SW4 HS1=5V_HS_3 HS2=5V_HS_4 LS1=5V_LS_3 LS2=5V_LS_4 PWR=5V
Arduino_2560_schematics/Arduino switches/SA3: designators Q10=SA3.Q10 Q11=SA3.Q11 Q12=SA3.Q12 R11=SA3.R11 R12=SA3.R12; ports DIN1=5V_SW5 DIN2=5V_SW6 HS1=5V_HS_5 HS2=5V_HS_6 LS1=5V_LS_5 LS2=5V_LS_6 PWR=5V
Arduino_2560_schematics/Arduino switches/SA4: designators Q10=SA4.Q10 Q11=SA4.Q11 Q12=SA4.Q12 R11=SA4.R11 R12=SA4.R12; ports DIN1=5V_SW7 DIN2=5V_SW8 HS1=5V_HS_7 HS2=5V_HS_8 LS1=5V_LS_7 LS2=5V_LS_8 PWR=5V
Arduino_2560_schematics/Arduino switches/SA5: designators Q10=SA5.Q10 Q11=SA5.Q11 Q12=SA5.Q12 R11=SA5.R11 R12=SA5.R12; ports DIN1=5V_SW9 DIN2=5V_SW10 HS1=5V_HS_9 HS2=5V_HS_10 LS1=5V_LS_9 LS2=5V_LS_10 PWR=5V
Arduino_2560_schematics/Arduino switches/SA9: designators Q10=SA9.Q10 Q11=SA9.Q11 Q12=SA9.Q12 R11=SA9.R11 R12=SA9.R12; ports DIN1=5V_SW17 DIN2=5V_SW18 HS1=5V_HS_17 HS2=5V_HS_18 LS1=5V_LS_17 LS2=5V_LS_18 PWR=5V
Arduino_2560_schematics/Arduino switches/SA10: designators Q10=SA10.Q10 Q11=SA10.Q11 Q12=SA10.Q12 R11=SA10.R11 R12=SA10.R12; ports DIN1=5V_SW19 DIN2=5V_SW20 HS1=5V_HS_19 HS2=5V_HS_20 LS1=5V_LS_19 LS2=5V_LS_20 PWR=5V
Arduino_2560_schematics/Arduino switches/SA11: designators Q10=SA11.Q10 Q11=SA11.Q11 Q12=SA11.Q12 R11=SA11.R11 R12=SA11.R12; ports DIN1=5V_SW21 DIN2=5V_SW22 HS1=5V_HS_21 HS2=5V_HS_22 LS1=5V_LS_21 LS2=5V_LS_22 PWR=5V
Arduino_2560_schematics/Arduino switches/SA12: designators Q10=SA12.Q10 Q11=SA12.Q11 Q12=SA12.Q12 R11=SA12.R11 R12=SA12.R12; ports DIN1=5V_SW23 DIN2=5V_SW24 HS1=5V_HS_23 HS2=5V_HS_24 LS1=5V_LS_23 LS2=5V_LS_24 PWR=5V
Arduino_2560_schematics/Arduino switches/SA13: designators Q10=SA13.Q10 Q11=SA13.Q11 Q12=SA13.Q12 R11=SA13.R11 R12=SA13.R12; ports DIN1=5V_SW25 DIN2=5V_SW26 HS1=5V_HS_25 HS2=5V_HS_26 LS1=5V_LS_25 LS2=5V_LS_26 PWR=5V
Arduino_2560_schematics/Arduino switches/SA14: designators Q10=SA14.Q10 Q11=SA14.Q11 Q12=SA14.Q12 R11=SA14.R11 R12=SA14.R12; ports DIN1=5V_SW27 DIN2=5V_SW28 HS1=5V_HS_27 HS2=5V_HS_28 LS1=5V_LS_27 LS2=5V_LS_28 PWR=5V
Arduino_2560_schematics/Arduino switches/SA6: designators Q10=SA6.Q10 Q11=SA6.Q11 Q12=SA6.Q12 R11=SA6.R11 R12=SA6.R12; ports DIN1=5V_SW11 DIN2=5V_SW12 HS1=5V_HS_11 HS2=5V_HS_12 LS1=5V_LS_11 LS2=5V_LS_12 PWR=5V
Arduino_2560_schematics/Arduino switches/SA7: designators Q10=SA7.Q10 Q11=SA7.Q11 Q12=SA7.Q12 R11=SA7.R11 R12=SA7.R12; ports DIN1=5V_SW13 DIN2=5V_SW14 HS1=5V_HS_13 HS2=5V_HS_14 LS1=5V_LS_13 LS2=5V_LS_14 PWR=5V
Arduino_2560_schematics/Arduino switches/SA8: designators Q10=SA8.Q10 Q11=SA8.Q11 Q12=SA8.Q12 R11=SA8.R11 R12=SA8.R12; ports DIN1=5V_SW15 DIN2=5V_SW16 HS1=5V_HS_15 HS2=5V_HS_16 LS1=5V_LS_15 LS2=5V_LS_16 PWR=5V

### Notes on the sheet
- Title
- Size
- Date:
- A4
- Number
- Time:
- Sheet
- of
- Revision
- File:
- Drawn By:

### Library data of the parts
Q10 Q11 = BC848B: NPN Silicon AF Transistor, 30 V VCEO, 100 mA IC, SOT23, Reel, Green; Manufacturer: Infineon; fT (typ): 250 MHz; Green: TRUE; IBM (max): 200 mA; IC (max): 100 mA; ICBO (max): 15 nA; Ptot (max): 330 mW; VCBO (max): 30 V; VEBO (max): 6 V; PackageVersion: Apr-08; PackageReference: SOT23; PackageDescription: 3-Pin Small Outline Transistor Package, 1.3 x 2.9 mm Body, 0.95 mm Pitch; ICM (max): 200 mA; Packing: Reel; Polarity: NPN; VCEO (max): 30 V; Mounting Technology: Surface Mount; PartNumber: BC848B; ComponentLink1Description: Manufacturer URL; ComponentLink1URL: http://www.infineon.com/; ComponentLink2Description: Datasheet; ComponentLink2URL: http://www.infineon.com/dgdl/bc847series_bc848series_bc849series_bc850series.pdf?folderId=db3a304314dca389011541d30fa21656&fileId=db3a304314dca389011541d4630a1657; ComponentLink3Description: Package Specification; ComponentLink3URL: http://www.infineon.com/dgdl/SOT23-Package_Overview.pdf?folderId=db3a30431936bc4b0119532290053c66&fileId=db3a30431936bc4b0119533468123c85
Q12 = TC8220: Two pair, N- & P-Channel Enhancement MOSFET; PackageReference: DFN-12
R11 R12 = Res2: Resistor; Published: 8-Jun-2000; LatestRevisionDate: 17-Jul-2002; LatestRevisionNote: Re-released for DXP Platform.; PackageReference: 1206; Publisher: Altium Limited; PackageDescription: Chip Resistor 1206 Case Size; Value: 330

## Sheet Arduino_schematics.SchDoc: Data Logger - Arduino
size A3; DocumentNumber: DL-MB-2; Revision: 3.2.1B; SheetNumber: 2; SheetTotal: 11
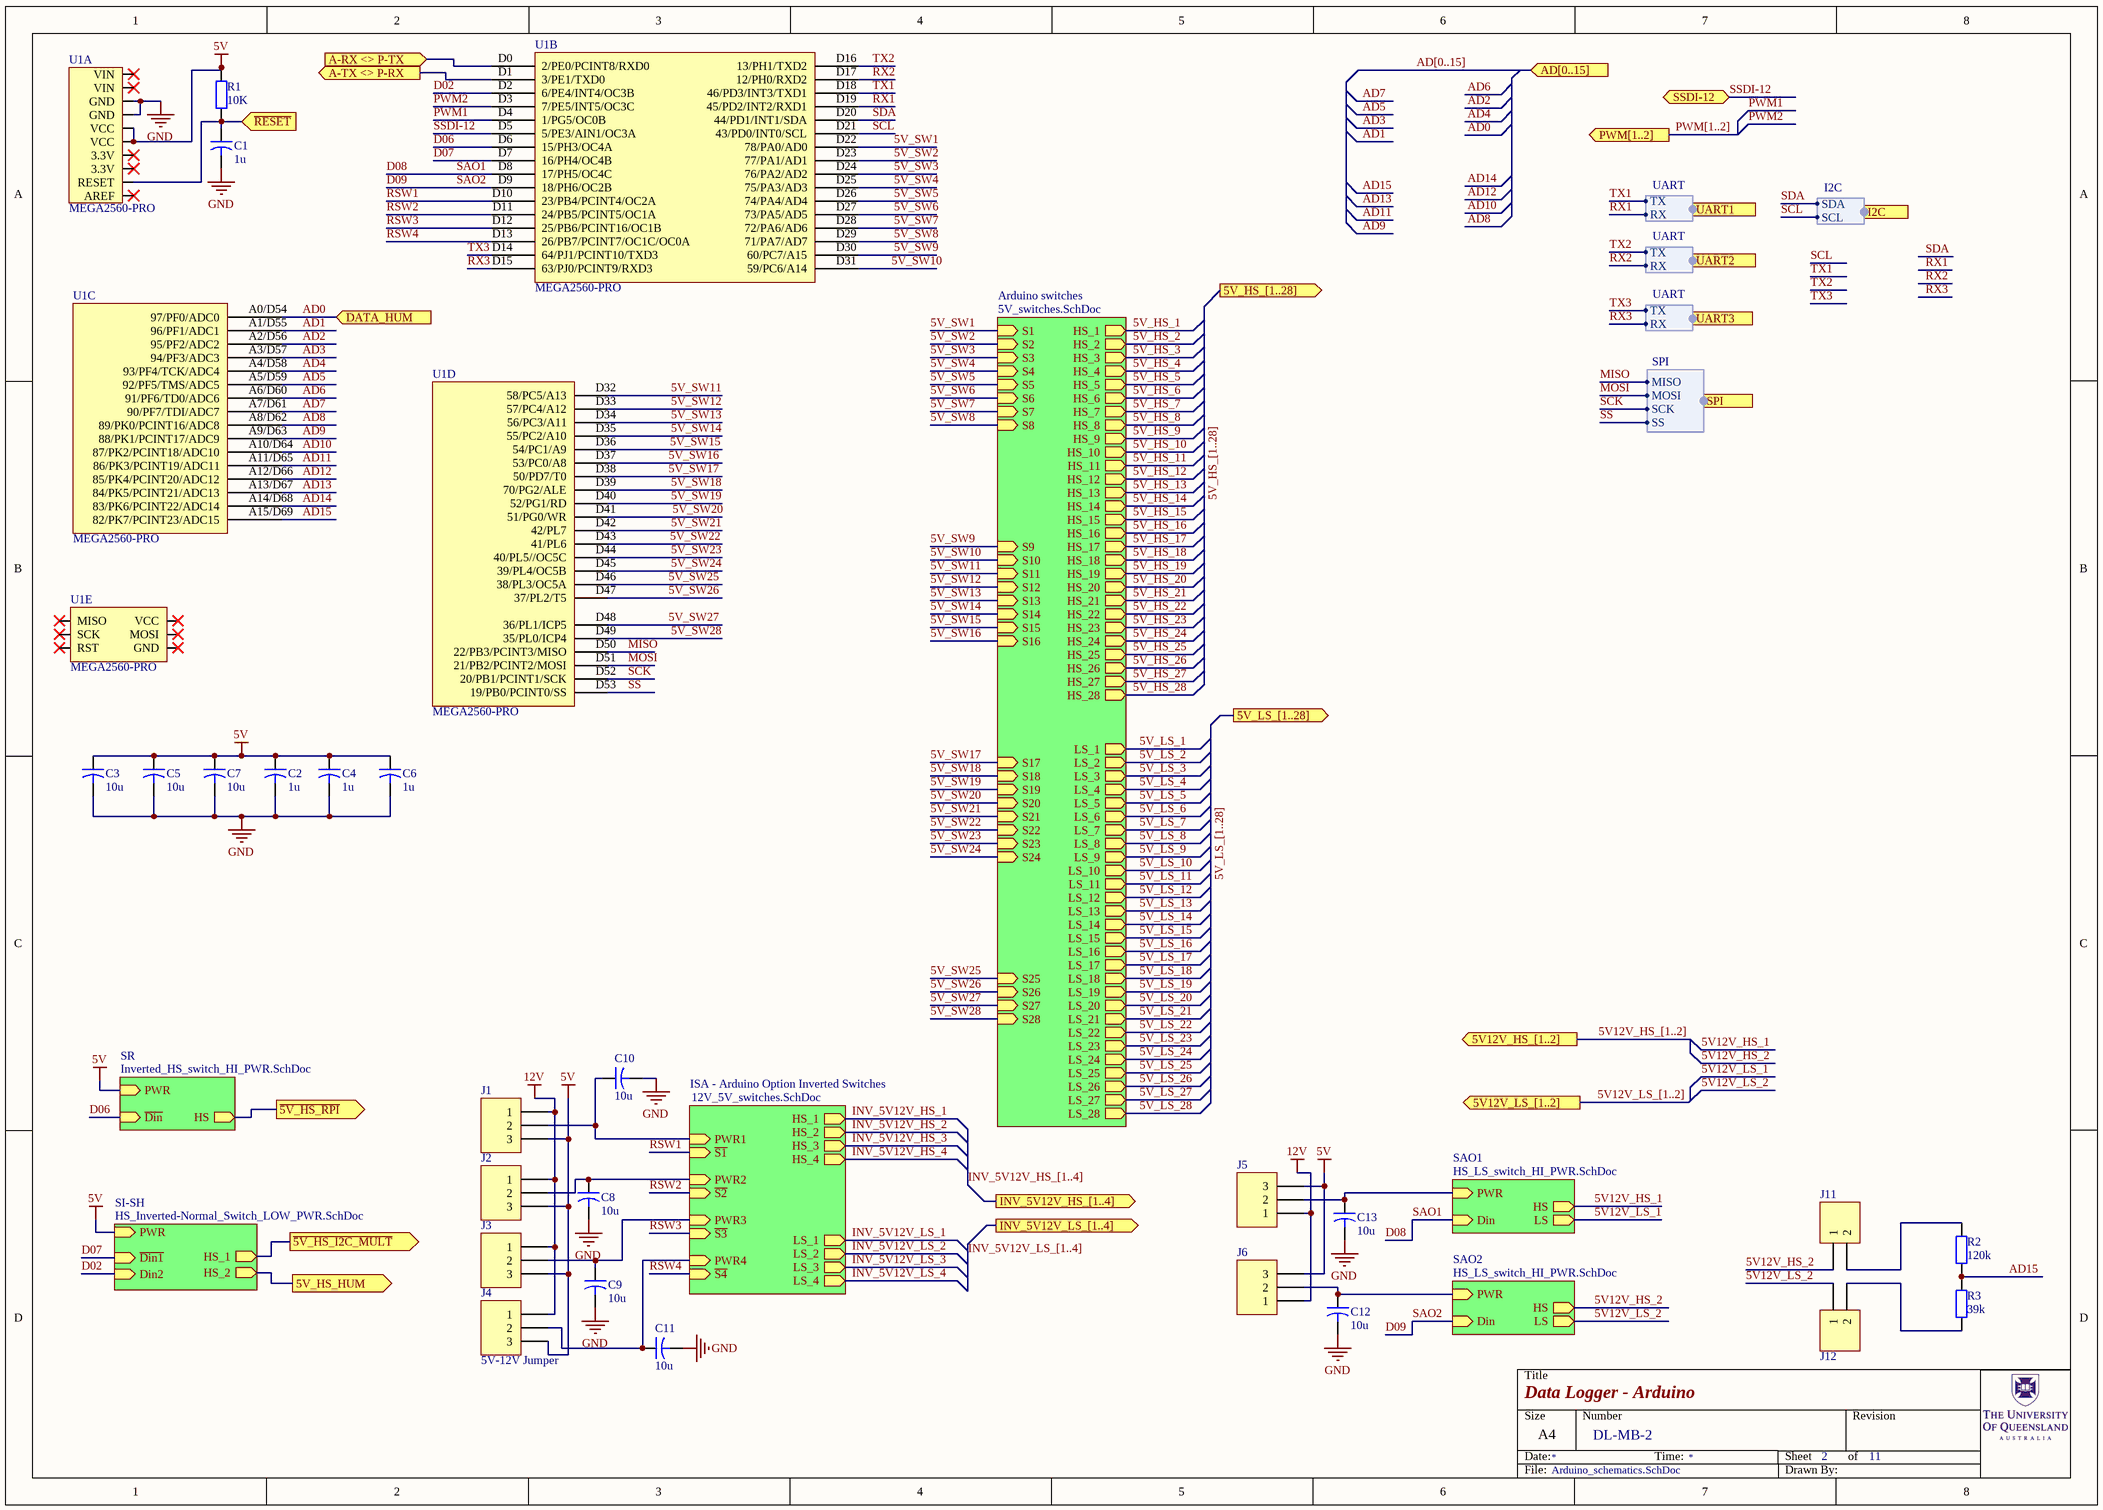
[diagram p4: Arduino_schematics.SchDoc]

### Parts
C1  1u  [CAPR5-4X5]
C2  1u  [CAPR5-4X5]
C3  10u  [CAPAE9083X80M]
C4  1u  [CAPR5-4X5]
C5  10u  [CAPAE9083X80M]
C6  1u  [CAPR5-4X5]
C7  10u  [CAPAE9083X80M]
C8  10u  [CAPAE9083X80M]
C9  10u  [CAPAE9083X80M]
C10  10u  [CAPAE9083X80M]
C11  10u  [CAPAE9083X80M]
C12  10u  [CAPAE9083X80M]
C13  10u  [CAPAE9083X80M]
J1  5V-12V Jumper  [HDR1X3]  (value not drawn)
J2  5V-12V Jumper  [HDR1X3]  (value not drawn)
J3  5V-12V Jumper  [HDR1X3]  (value not drawn)
J4  5V-12V Jumper  [HDR1X3]
J5  Header 3  [HDR1X3]  (value not drawn)
J6  Header 3  [HDR1X3]  (value not drawn)
J11  Header 2  [HDR1X2]  (value not drawn)
J12  Header 2  [HDR1X2]  (value not drawn)
R1  10K  [RES-1206_M]
R2  120k  [RES-1206_M]
R3  39k  [RES-1206_M]
U1  MEGA2560-PRO  [MEGA2560PRO-EMBED-IO]  (parts A,B,C,D,E of 5)

### Sub-sheets
Arduino switches = 5V_switches.SchDoc: S1 (in), S2 (in), S3 (in), S4 (in), S5 (in), S6 (in), S7 (in), S8 (in), S9 (in), S10 (in), S11 (in), S12 (in), S13 (in), S14 (in), S15 (in), S16 (in), S17 (in), S18 (in), S19 (in), S20 (in), S21 (in), S22 (in), S23 (in), S24 (in), S25 (in), S26 (in), S27 (in), HS_1 (out), HS_2 (out), HS_3 (out), HS_4 (out), HS_5 (out), HS_6 (out), HS_7 (out), HS_8 (out), HS_9 (out), HS_10 (out), HS_11 (out), HS_12 (out), HS_13 (out), HS_14 (out), HS_15 (out), HS_16 (out), HS_17 (out), HS_18 (out), HS_19 (out), HS_20 (out), HS_21 (out), HS_22 (out), HS_23 (out), HS_24 (out), HS_25 (out), HS_26 (out), HS_27 (out), S28 (in), HS_28 (out), LS_1 (out), LS_2 (out), LS_3 (out), LS_4 (out), LS_5 (out), LS_6 (out), LS_7 (out), LS_8 (out), LS_9 (out), LS_10 (out), LS_11 (out), LS_12 (out), LS_13 (out), LS_14 (out), LS_15 (out), LS_16 (out), LS_17 (out), LS_18 (out), LS_19 (out), LS_20 (out), LS_21 (out), LS_22 (out), LS_23 (out), LS_24 (out), LS_25 (out), LS_26 (out), LS_27 (out), LS_28 (out)
ISA - Arduino Option Inverted Switches = 12V_5V_switches.SchDoc: ~{S1} (in), ~{S2} (in), ~{S3} (in), ~{S4} (in), HS_1 (out), HS_2 (out), HS_3 (out), HS_4 (out), LS_1 (out), LS_2 (out), LS_3 (out), LS_4 (out), PWR1 (in), PWR2 (in), PWR3 (in), PWR4 (in)
SAO1 = HS_LS_switch_HI_PWR.SchDoc: Din (in), HS (out), LS (out), PWR (in)
SAO2 = HS_LS_switch_HI_PWR.SchDoc: Din (in), HS (out), LS (out), PWR (in)
SI-SH = HS_Inverted-Normal_Switch_LOW_PWR.SchDoc: ~{Din1} (in), HS_1 (out), PWR (in), Din2 (in), HS_2 (out)
SR = Inverted_HS_switch_HI_PWR.SchDoc: ~{Din} (in), HS (out), PWR (in)

### Ports
5V12V_HS_[1..2] (out), 5V12V_LS_[1..2] (out), 5V_HS_[1..28] (out), 5V_HS_HUM (out), 5V_LS_[1..28] (out), A-RX <> P-TX (in), A-TX <> P-RX (out), AD[0..15] (in), DATA_HUM (in), I2C (harness I2C), INV_5V12V_HS_[1..4] (out), INV_5V12V_LS_[1..4] (out), PWM[1..2] (out), SPI (harness SPI), SSDI-12 (bidir), UART1 (harness UART), UART2 (harness UART), UART3 (harness UART), ~{5V_HS_I2C_MULT} (out), ~{5V_HS_RPI} (out), ~{RESET} (in)

### Harnesses
SPI: MISO, MOSI, SCK, SS
UART: TX, RX
I2C: SDA, SCL

### Nets
5V: C2.1 C3.1 C4.1 C5.1 C6.1 C7.1 C8.1 C9.1 C10.1 C11.1 J1.2 J1.3 J2.2 J2.3 J3.2 J3.3 J4.2 J4.3 J5.3 J6.3 R1.2 U1.VCC@1(VCC) U1.VCC@2(VCC) ; sheet ISA - Arduino Option Inverted Switches/PWR1, sheet ISA - Arduino Option Inverted Switches/PWR2, sheet ISA - Arduino Option Inverted Switches/PWR3, sheet ISA - Arduino Option Inverted Switches/PWR4, sheet SI-SH/PWR, sheet SR/PWR
12V: J1.1 J2.1 J3.1 J4.1 J5.1 J6.1
GND: C1.2 C2.2 C3.2 C4.2 C5.2 C6.2 C7.2 C8.2 C9.2 C10.2 C11.2 C12.2 C13.2 U1.GND@1(GND) U1.GND@2(GND)
5V12V_HS_2: J11.1 ; sheet SAO2/HS
5V12V_LS_2: J12.1 ; sheet SAO2/LS
5V_SW1: U1.D22(78/PA0/AD0) ; sheet Arduino switches/S1
5V_SW2: U1.D23(77/PA1/AD1) ; sheet Arduino switches/S2
5V_SW3: U1.D24(76/PA2/AD2) ; sheet Arduino switches/S3
5V_SW4: U1.D25(75/PA3/AD3) ; sheet Arduino switches/S4
5V_SW5: U1.D26(74/PA4/AD4) ; sheet Arduino switches/S5
5V_SW6: U1.D27(73/PA5/AD5) ; sheet Arduino switches/S6
5V_SW7: U1.D28(72/PA6/AD6) ; sheet Arduino switches/S7
5V_SW8: U1.D29(71/PA7/AD7) ; sheet Arduino switches/S8
5V_SW9: U1.D30(60/PC7/A15) ; sheet Arduino switches/S9
5V_SW10: U1.D31(59/PC6/A14) ; sheet Arduino switches/S10
5V_SW11: U1.D32(58/PC5/A13) ; sheet Arduino switches/S11
5V_SW12: U1.D33(57/PC4/A12) ; sheet Arduino switches/S12
5V_SW13: U1.D34(56/PC3/A11) ; sheet Arduino switches/S13
5V_SW14: U1.D35(55/PC2/A10) ; sheet Arduino switches/S14
5V_SW15: U1.D36(54/PC1/A9) ; sheet Arduino switches/S15
5V_SW16: U1.D37(53/PC0/A8) ; sheet Arduino switches/S16
5V_SW17: U1.D38(50/PD7/T0) ; sheet Arduino switches/S17
5V_SW18: U1.D39(70/PG2/ALE) ; sheet Arduino switches/S18
5V_SW19: U1.D40(52/PG1/RD) ; sheet Arduino switches/S19
5V_SW20: U1.D41(51/PG0/WR) ; sheet Arduino switches/S20
5V_SW21: U1.D42(42/PL7) ; sheet Arduino switches/S21
5V_SW22: U1.D43(41/PL6) ; sheet Arduino switches/S22
5V_SW23: U1.D44(40/PL5//OC5C) ; sheet Arduino switches/S23
5V_SW24: U1.D45(39/PL4/OC5B) ; sheet Arduino switches/S24
5V_SW25: U1.D46(38/PL3/OC5A) ; sheet Arduino switches/S25
5V_SW26: U1.D47(37/PL2/T5) ; sheet Arduino switches/S26
5V_SW27: U1.D48(36/PL1/ICP5) ; sheet Arduino switches/S27
5V_SW28: U1.D49(35/PL0/ICP4) ; sheet Arduino switches/S28
A_RX0: U1.D0(2/PE0/PCINT8/RXD0) ; port A-RX <> P-TX
A_TX0: U1.D1(3/PE1/TXD0) ; port A-TX <> P-RX
AD0: U1.A0/D54(97/PF0/ADC0) ; port DATA_HUM
AD1: U1.A1/D55(96/PF1/ADC1)
AD2: U1.A2/D56(95/PF2/ADC2)
AD3: U1.A3/D57(94/PF3/ADC3)
AD4: U1.A4/D58(93/PF4/TCK/ADC4)
AD5: U1.A5/D59(92/PF5/TMS/ADC5)
AD6: U1.A6/D60(91/PF6/TD0/ADC6)
AD7: U1.A7/D61(90/PF7/TDI/ADC7)
AD8: U1.A8/D62(89/PK0/PCINT16/ADC8)
AD9: U1.A9/D63(88/PK1/PCINT17/ADC9)
AD10: U1.A10/D64(87/PK2/PCINT18/ADC10)
AD11: U1.A11/D65(86/PK3/PCINT19/ADC11)
AD12: U1.A12/D66(85/PK4/PCINT20/ADC12)
AD13: U1.A13/D67(84/PK5/PCINT21/ADC13)
AD14: U1.A14/D68(83/PK6/PCINT22/ADC14)
AD15: R2.1 R3.2 U1.A15/D69(82/PK7/PCINT23/ADC15)
D02: U1.D2(6/PE4/INT4/OC3B) ; sheet SI-SH/Din2
D06: U1.D6(15/PH3/OC4A) ; sheet SR/~{Din}
D07: U1.D7(16/PH4/OC4B) ; sheet SI-SH/~{Din1}
D08: U1.D8(17/PH5/OC4C) ; sheet SAO1/Din  [also labelled SAO1]
D09: U1.D9(18/PH6/OC2B) ; sheet SAO2/Din  [also labelled SAO2]
HS_I2C_SW: port ~{5V_HS_I2C_MULT}, sheet SI-SH/HS_1
MISO: U1.D50(22/PB3/PCINT3/MISO) ; port SPI.MISO
MOSI: U1.D51(21/PB2/PCINT2/MOSI) ; port SPI.MOSI
PI_13: C1.1 R1.1 U1.RST@1(RESET) ; port ~{RESET}
PWM1: U1.D4(1/PG5/OC0B)
PWM2: U1.D3(7/PE5/INT5/OC3C)
RSW1: U1.D10(23/PB4/PCINT4/OC2A) ; sheet ISA - Arduino Option Inverted Switches/~{S1}
RSW2: U1.D11(24/PB5/PCINT5/OC1A) ; sheet ISA - Arduino Option Inverted Switches/~{S2}
RSW3: U1.D12(25/PB6/PCINT16/OC1B) ; sheet ISA - Arduino Option Inverted Switches/~{S3}
RSW4: U1.D13(26/PB7/PCINT7/OC1C/OC0A) ; sheet ISA - Arduino Option Inverted Switches/~{S4}
RX1: U1.D19(45/PD2/INT2/RXD1) ; port UART1.RX  [project net A_RX1]
RX2: U1.D17(12/PH0/RXD2) ; port UART2.RX  [project net A_RX2]
RX3: U1.D15(63/PJ0/PCINT9/RXD3) ; port UART3.RX  [project net A_RX3]
SCK: U1.D52(20/PB1/PCINT1/SCK) ; port SPI.SCK
SCL: U1.D21(43/PD0/INT0/SCL) ; port I2C.SCL  [project net ard_scl_21]
SDA: U1.D20(44/PD1/INT1/SDA) ; port I2C.SDA  [project net ard_sda_20]
SS: U1.D53(19/PB0/PCINT0/SS) ; port SPI.SS
SSDI-12: U1.D5(5/PE3/AIN1/OC3A) ; port SSDI-12
TX1: U1.D18(46/PD3/INT3/TXD1) ; port UART1.TX  [project net A_TX1]
TX2: U1.D16(13/PH1/TXD2) ; port UART2.TX  [project net A_TX2]
TX3: U1.D14(64/PJ1/PCINT10/TXD3) ; port UART3.TX  [project net A_TX3]
NetC12_1: C12.1 J6.2 ; sheet SAO2/PWR
NetC13_1: C13.1 J5.2 ; sheet SAO1/PWR
NetC29_1: port 5V_HS_HUM, sheet SI-SH/HS_2
NetJ7_2: port ~{5V_HS_RPI}, sheet SR/HS
NetJ11_2: J11.2 R2.2
NetJ12_2: J12.2 R3.1

Not connected (* = marked no-connect by the designer): U1 3.3V@1(3.3V)* 3.3V@2(3.3V)* 5V@3(VCC)* AREF* GND@3(GND)* MISO* MOSI* RESET(RST)* SCK* VIN@1(VIN)* VIN@2(VIN)*

### Buses and harness runs
bus 5V12V_HS_[1..2] = port 5V12V_HS_[1..2]
bus 5V12V_LS_[1..2] = port 5V12V_LS_[1..2]
bus 5V_HS_[1..28] = port 5V_HS_[1..28]
bus 5V_LS_[1..28] = port 5V_LS_[1..28]
bus AD[0..15] = port AD[0..15]
bus INV_5V12V_HS_[1..4] = port INV_5V12V_HS_[1..4]
bus INV_5V12V_LS_[1..4] = port INV_5V12V_LS_[1..4]
bus PWM[1..2] = port PWM[1..2]

### Notes on the sheet
- Title
- Size
- Date:
- A4
- Number
- Time:
- Sheet
- of
- Revision
- File:
- Drawn By:

### Library data of the parts
C1-C13 = Cap Pol1: Capacitor; Publisher: Altium Limited; PackageDescription: Polarized Capacitor; 2 Leads
  C1 C2 C4 C6: Published: 23-Sep-02; Value: 1u; Link: https://au.rs-online.com/web/p/ceramic-multilayer-capacitors/6995137/
  C3 C5 C7: Published: 23-Sep-2002; Value: 10u
  C8-C13: Published: 23-Sep-02; Value: 10u; Link: https://au.rs-online.com/web/p/aluminium-capacitors/2244325/
J1 = Header 3: Header, 3-Pin / ISA1 (D10), Inverted Switch 12V-5V Select; LatestRevisionDate: 17-Jul-2002; LatestRevisionNote: Re-released for DXP Platform.; Publisher: Altium Limited
J2 = Header 3: Header, 3-Pin / ISA2 (D11), Inverted Switch 12V-5V Select; LatestRevisionDate: 17-Jul-2002; LatestRevisionNote: Re-released for DXP Platform.; Publisher: Altium Limited
J3 = Header 3: Header, 3-Pin / ISA3 (D12), Inverted Switch 12V-5V Select; LatestRevisionDate: 17-Jul-2002; LatestRevisionNote: Re-released for DXP Platform.; Publisher: Altium Limited
J4 = Header 3: Header, 3-Pin / ISA4 (D13), Inverted Switch 12V-5V Select; LatestRevisionDate: 17-Jul-2002; LatestRevisionNote: Re-released for DXP Platform.; Publisher: Altium Limited
J5 = Header 3: Header, 3-Pin / SAO1 (D8), 12V 5V Select; LatestRevisionDate: 17-Jul-2002; LatestRevisionNote: Re-released for DXP Platform.; Publisher: Altium Limited
J6 = Header 3: Header, 3-Pin / SAO2 (D9), 12V 5V Select; LatestRevisionDate: 17-Jul-2002; LatestRevisionNote: Re-released for DXP Platform.; Publisher: Altium Limited
J11 = Header 2: Header, 2-Pin / VSense, HS; LatestRevisionDate: 17-Jul-2002; LatestRevisionNote: Re-released for DXP Platform.; Publisher: Altium Limited
J12 = Header 2: Header, 2-Pin / VSense, LS; LatestRevisionDate: 17-Jul-2002; LatestRevisionNote: Re-released for DXP Platform.; Publisher: Altium Limited
R1-R3 = Res2: Resistor; Published: 8-Jun-2000; LatestRevisionDate: 17-Jul-2002; LatestRevisionNote: Re-released for DXP Platform.; PackageReference: 1206; Publisher: Altium Limited; PackageDescription: Chip Resistor 1206 Case Size
  R1: Value: 10K
  R2: Value: 120k
  R3: Value: 39k
U1 = MEGA2560-PRO: RoboDyn Mega2560 Pro (Embed) CH340G; ComponentLink1Description: Robodyn; ComponentLink1URL: https://robotdyn.com/mega-2560-pro-embed-ch340g-atmega2560-16au.html

## Sheet 5V_switches.SchDoc: Data Logger - 5V Switches
size A4; DocumentNumber: DL-MB-5; Revision: 3.2.1B; SheetNumber: 5; SheetTotal: 11
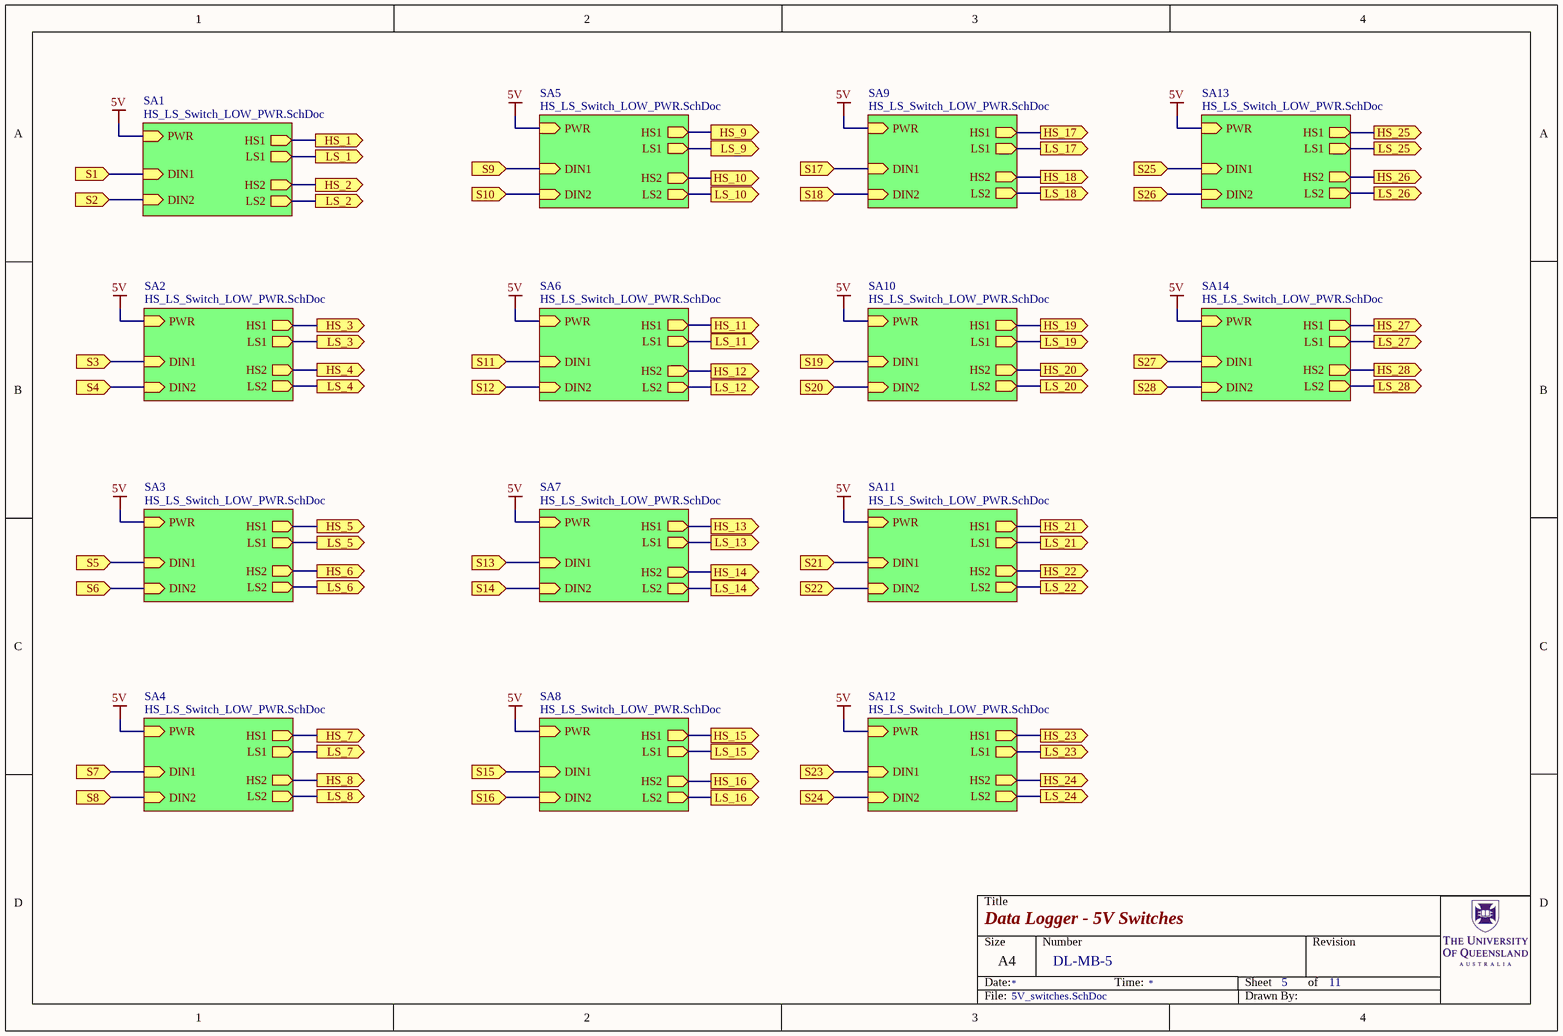
[diagram p5: 5V_switches.SchDoc]

### Sub-sheets
SA1 = HS_LS_Switch_LOW_PWR.SchDoc: DIN1 (in), DIN2 (in), HS1 (out), LS1 (out), HS2 (out), LS2 (out), PWR (in)
SA2 = HS_LS_Switch_LOW_PWR.SchDoc: DIN1 (in), DIN2 (in), HS1 (out), LS1 (out), HS2 (out), LS2 (out), PWR (in)
SA3 = HS_LS_Switch_LOW_PWR.SchDoc: DIN1 (in), DIN2 (in), HS1 (out), LS1 (out), HS2 (out), LS2 (out), PWR (in)
SA4 = HS_LS_Switch_LOW_PWR.SchDoc: DIN1 (in), DIN2 (in), HS1 (out), LS1 (out), HS2 (out), LS2 (out), PWR (in)
SA5 = HS_LS_Switch_LOW_PWR.SchDoc: DIN1 (in), DIN2 (in), HS1 (out), LS1 (out), HS2 (out), LS2 (out), PWR (in)
SA6 = HS_LS_Switch_LOW_PWR.SchDoc: DIN1 (in), DIN2 (in), HS1 (out), LS1 (out), HS2 (out), LS2 (out), PWR (in)
SA7 = HS_LS_Switch_LOW_PWR.SchDoc: DIN1 (in), DIN2 (in), HS1 (out), LS1 (out), HS2 (out), LS2 (out), PWR (in)
SA8 = HS_LS_Switch_LOW_PWR.SchDoc: DIN1 (in), DIN2 (in), HS1 (out), LS1 (out), HS2 (out), LS2 (out), PWR (in)
SA9 = HS_LS_Switch_LOW_PWR.SchDoc: DIN1 (in), DIN2 (in), HS1 (out), LS1 (out), HS2 (out), LS2 (out), PWR (in)
SA10 = HS_LS_Switch_LOW_PWR.SchDoc: DIN1 (in), DIN2 (in), HS1 (out), LS1 (out), HS2 (out), LS2 (out), PWR (in)
SA11 = HS_LS_Switch_LOW_PWR.SchDoc: DIN1 (in), DIN2 (in), HS1 (out), LS1 (out), HS2 (out), LS2 (out), PWR (in)
SA12 = HS_LS_Switch_LOW_PWR.SchDoc: DIN1 (in), DIN2 (in), HS1 (out), LS1 (out), HS2 (out), LS2 (out), PWR (in)
SA13 = HS_LS_Switch_LOW_PWR.SchDoc: DIN1 (in), DIN2 (in), HS1 (out), LS1 (out), HS2 (out), LS2 (out), PWR (in)
SA14 = HS_LS_Switch_LOW_PWR.SchDoc: DIN1 (in), DIN2 (in), HS1 (out), LS1 (out), HS2 (out), LS2 (out), PWR (in)

### Ports
HS_1 (out), HS_2 (out), HS_3 (out), HS_4 (out), HS_5 (out), HS_6 (out), HS_7 (out), HS_8 (out), HS_9 (out), HS_10 (out), HS_11 (out), HS_12 (out), HS_13 (out), HS_14 (out), HS_15 (out), HS_16 (out), HS_17 (out), HS_18 (out), HS_19 (out), HS_20 (out), HS_21 (out), HS_22 (out), HS_23 (out), HS_24 (out), HS_25 (out), HS_26 (out), HS_27 (out), HS_28 (out), LS_1 (out), LS_2 (out), LS_3 (out), LS_4 (out), LS_5 (out), LS_6 (out), LS_7 (out), LS_8 (out), LS_9 (out), LS_10 (out), LS_11 (out), LS_12 (out), LS_13 (out), LS_14 (out), LS_15 (out), LS_16 (out), LS_17 (out), LS_18 (out), LS_19 (out), LS_20 (out), LS_21 (out), LS_22 (out), LS_23 (out), LS_24 (out), LS_25 (out), LS_26 (out), LS_27 (out), LS_28 (out), S1 (in), S2 (in), S3 (in), S4 (in), S5 (in), S6 (in), S7 (in), S8 (in), S9 (in), S10 (in), S11 (in), S12 (in), S13 (in), S14 (in), S15 (in), S16 (in), S17 (in), S18 (in), S19 (in), S20 (in), S21 (in), S22 (in), S23 (in), S24 (in), S25 (in), S26 (in), S27 (in), S28 (in)

### Nets
5V: sheet SA1/PWR, sheet SA2/PWR, sheet SA3/PWR, sheet SA4/PWR, sheet SA5/PWR, sheet SA9/PWR, sheet SA10/PWR, sheet SA11/PWR, sheet SA12/PWR, sheet SA13/PWR, sheet SA14/PWR, sheet SA6/PWR, sheet SA7/PWR, sheet SA8/PWR
5V_HS_1: port HS_1, sheet SA1/HS1
5V_HS_2: port HS_2, sheet SA1/HS2
5V_HS_3: port HS_3, sheet SA2/HS1
5V_HS_4: port HS_4, sheet SA2/HS2
5V_HS_5: port HS_5, sheet SA3/HS1
5V_HS_6: port HS_6, sheet SA3/HS2
5V_HS_7: port HS_7, sheet SA4/HS1
5V_HS_8: port HS_8, sheet SA4/HS2
5V_HS_9: port HS_9, sheet SA5/HS1
5V_HS_10: port HS_10, sheet SA5/HS2
5V_HS_11: port HS_11, sheet SA6/HS1
5V_HS_12: port HS_12, sheet SA6/HS2
5V_HS_13: port HS_13, sheet SA7/HS1
5V_HS_14: port HS_14, sheet SA7/HS2
5V_HS_15: port HS_15, sheet SA8/HS1
5V_HS_16: port HS_16, sheet SA8/HS2
5V_HS_17: port HS_17, sheet SA9/HS1
5V_HS_18: port HS_18, sheet SA9/HS2
5V_HS_19: port HS_19, sheet SA10/HS1
5V_HS_20: port HS_20, sheet SA10/HS2
5V_HS_21: port HS_21, sheet SA11/HS1
5V_HS_22: port HS_22, sheet SA11/HS2
5V_HS_23: port HS_23, sheet SA12/HS1
5V_HS_24: port HS_24, sheet SA12/HS2
5V_HS_25: port HS_25, sheet SA13/HS1
5V_HS_26: port HS_26, sheet SA13/HS2
5V_HS_27: port HS_27, sheet SA14/HS1
5V_HS_28: port HS_28, sheet SA14/HS2
5V_LS_1: port LS_1, sheet SA1/LS1
5V_LS_2: port LS_2, sheet SA1/LS2
5V_LS_3: port LS_3, sheet SA2/LS1
5V_LS_4: port LS_4, sheet SA2/LS2
5V_LS_5: port LS_5, sheet SA3/LS1
5V_LS_6: port LS_6, sheet SA3/LS2
5V_LS_7: port LS_7, sheet SA4/LS1
5V_LS_8: port LS_8, sheet SA4/LS2
5V_LS_9: port LS_9, sheet SA5/LS1
5V_LS_10: port LS_10, sheet SA5/LS2
5V_LS_11: port LS_11, sheet SA6/LS1
5V_LS_12: port LS_12, sheet SA6/LS2
5V_LS_13: port LS_13, sheet SA7/LS1
5V_LS_14: port LS_14, sheet SA7/LS2
5V_LS_15: port LS_15, sheet SA8/LS1
5V_LS_16: port LS_16, sheet SA8/LS2
5V_LS_17: port LS_17, sheet SA9/LS1
5V_LS_18: port LS_18, sheet SA9/LS2
5V_LS_19: port LS_19, sheet SA10/LS1
5V_LS_20: port LS_20, sheet SA10/LS2
5V_LS_21: port LS_21, sheet SA11/LS1
5V_LS_22: port LS_22, sheet SA11/LS2
5V_LS_23: port LS_23, sheet SA12/LS1
5V_LS_24: port LS_24, sheet SA12/LS2
5V_LS_25: port LS_25, sheet SA13/LS1
5V_LS_26: port LS_26, sheet SA13/LS2
5V_LS_27: port LS_27, sheet SA14/LS1
5V_LS_28: port LS_28, sheet SA14/LS2
5V_SW1: port S1, sheet SA1/DIN1
5V_SW2: port S2, sheet SA1/DIN2
5V_SW3: port S3, sheet SA2/DIN1
5V_SW4: port S4, sheet SA2/DIN2
5V_SW5: port S5, sheet SA3/DIN1
5V_SW6: port S6, sheet SA3/DIN2
5V_SW7: port S7, sheet SA4/DIN1
5V_SW8: port S8, sheet SA4/DIN2
5V_SW9: port S9, sheet SA5/DIN1
5V_SW10: port S10, sheet SA5/DIN2
5V_SW11: port S11, sheet SA6/DIN1
5V_SW12: port S12, sheet SA6/DIN2
5V_SW13: port S13, sheet SA7/DIN1
5V_SW14: port S14, sheet SA7/DIN2
5V_SW15: port S15, sheet SA8/DIN1
5V_SW16: port S16, sheet SA8/DIN2
5V_SW17: port S17, sheet SA9/DIN1
5V_SW18: port S18, sheet SA9/DIN2
5V_SW19: port S19, sheet SA10/DIN1
5V_SW20: port S20, sheet SA10/DIN2
5V_SW21: port S21, sheet SA11/DIN1
5V_SW22: port S22, sheet SA11/DIN2
5V_SW23: port S23, sheet SA12/DIN1
5V_SW24: port S24, sheet SA12/DIN2
5V_SW25: port S25, sheet SA13/DIN1
5V_SW26: port S26, sheet SA13/DIN2
5V_SW27: port S27, sheet SA14/DIN1
5V_SW28: port S28, sheet SA14/DIN2

### Notes on the sheet
- Title
- Size
- Date:
- A4
- Number
- Time:
- Sheet
- of
- Revision
- File:
- Drawn By:

## Sheet 12V_5V_switches.SchDoc: Data Logger - 12V,5V Switches
size A4; DocumentNumber: DL-MB-4; Revision: 3.2.1B; SheetNumber: 4; SheetTotal: 11
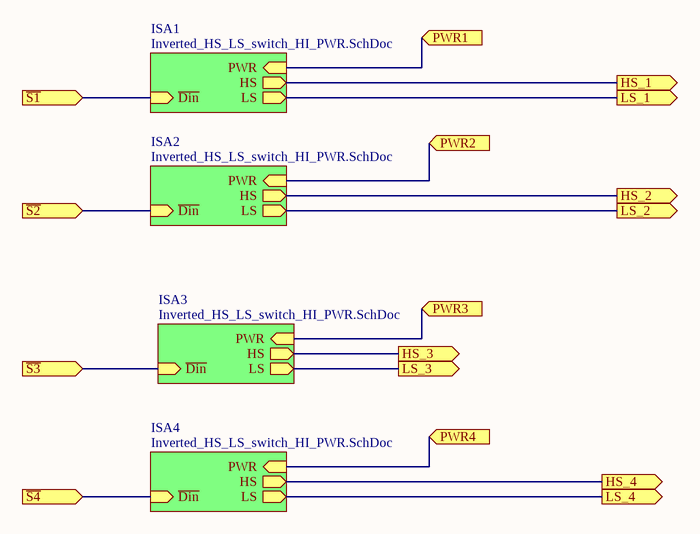
[diagram p6: 12V_5V_switches.SchDoc]

### Sub-sheets
ISA1 = Inverted_HS_LS_switch_HI_PWR.SchDoc: ~{Din} (in), HS (out), LS (out), PWR (in)
ISA2 = Inverted_HS_LS_switch_HI_PWR.SchDoc: ~{Din} (in), HS (out), LS (out), PWR (in)
ISA3 = Inverted_HS_LS_switch_HI_PWR.SchDoc: ~{Din} (in), HS (out), LS (out), PWR (in)
ISA4 = Inverted_HS_LS_switch_HI_PWR.SchDoc: ~{Din} (in), HS (out), LS (out), PWR (in)

### Ports
HS_1 (out), HS_2 (out), HS_3 (out), HS_4 (out), LS_1 (out), LS_2 (out), LS_3 (out), LS_4 (out), PWR1 (in), PWR2 (in), PWR3 (in), PWR4 (in), ~{S1} (in), ~{S2} (in), ~{S3} (in), ~{S4} (in)

### Nets
5V: port PWR3, port PWR4, port PWR2, port PWR1, sheet ISA3/PWR, sheet ISA4/PWR, sheet ISA1/PWR, sheet ISA2/PWR
INV_5V12V_HS_1: port HS_1, sheet ISA1/HS
INV_5V12V_HS_2: port HS_2, sheet ISA2/HS
INV_5V12V_HS_3: port HS_3, sheet ISA3/HS
INV_5V12V_HS_4: port HS_4, sheet ISA4/HS
INV_5V12V_LS_1: port LS_1, sheet ISA1/LS
INV_5V12V_LS_2: port LS_2, sheet ISA2/LS
INV_5V12V_LS_3: port LS_3, sheet ISA3/LS
INV_5V12V_LS_4: port LS_4, sheet ISA4/LS
RSW1: port ~{S1}, sheet ISA1/~{Din}
RSW2: port ~{S2}, sheet ISA2/~{Din}
RSW3: port ~{S3}, sheet ISA3/~{Din}
RSW4: port ~{S4}, sheet ISA4/~{Din}

### Notes on the sheet
- Title
- Size
- Date:
- A4
- Number
- Time:
- Sheet
- of
- Revision
- File:
- Drawn By: